# Altium project PCB_LDB-U01.PRJPCB (part 1 of 2)
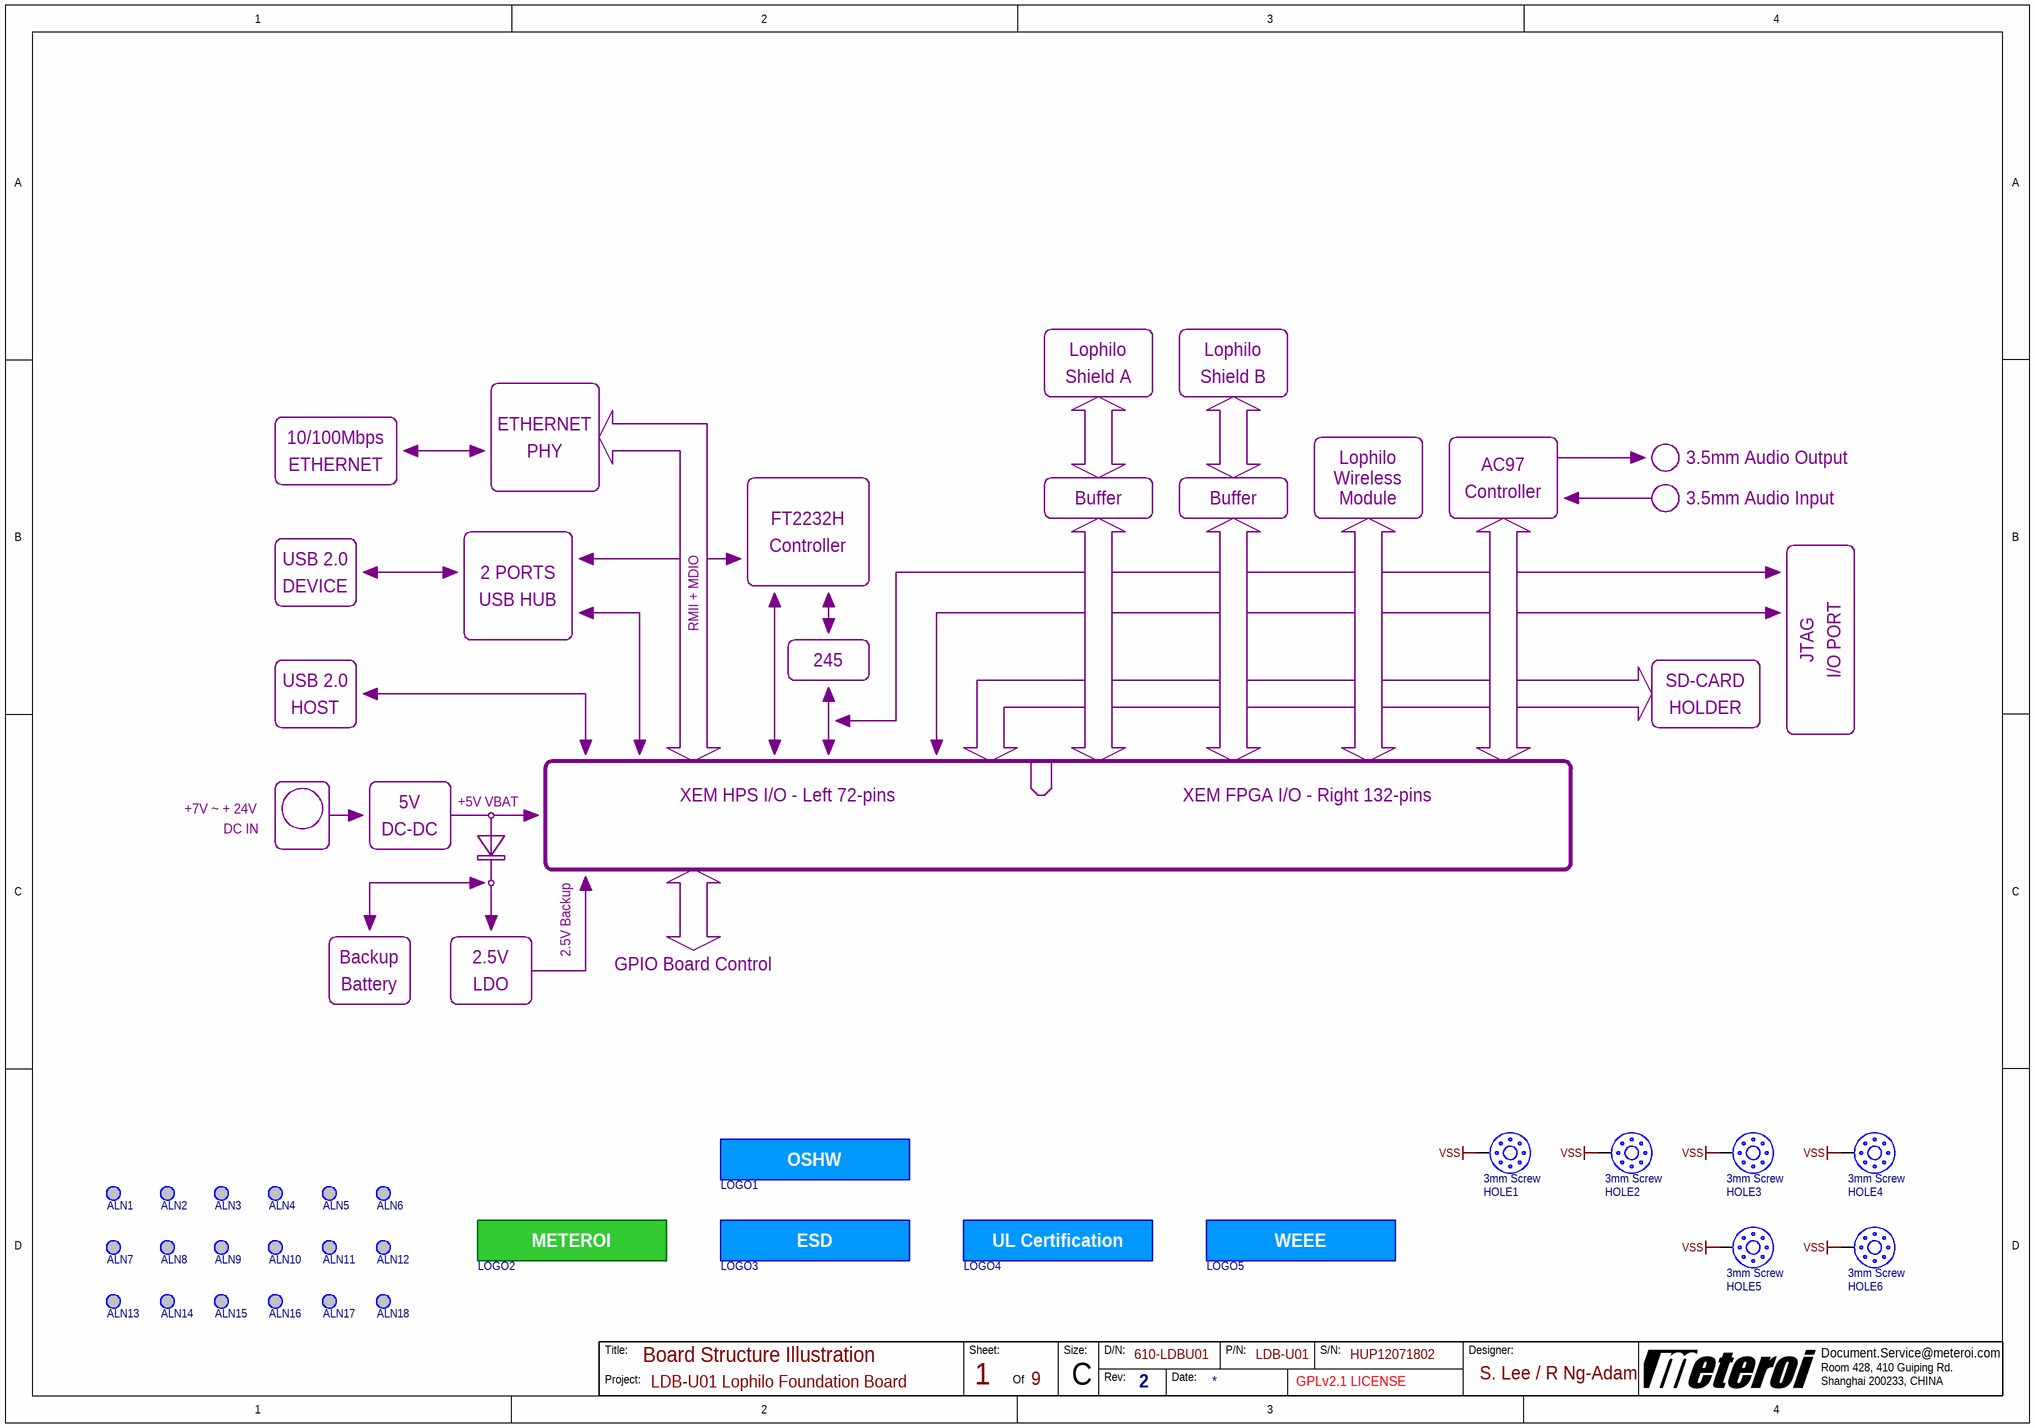
[diagram p0: 01_Structure.SchDoc]
ClassifiedLevel: GPLv2.1 LICENSE; Designer: S. Lee / R Ng-Adam; DocumentSerialNumber: 610-LDBU01; Email: Document.Service@meteroi.com; PartNumber: LDB-U01; PrjRevision: 2; SerialNumber: HUP12071802; SheetTotalNumber: 9; TopProjectName: LDB-U01 Lophilo Foundation Board
9 sheets, 286 parts. Net scope: global (net labels, ports and power ports of the same name join across sheets).
Board file: PCB_LDB-U01.PcbDoc
Sheets:
  01_Structure.SchDoc
  02_IO_PORTS.SchDoc
  03_SHIELD_SLOT_A.SchDoc
  04_SHIELD_SLOT_B.SchDoc
  05_USB_PORTS.SchDoc
  06_ETHERNET.SchDoc
  07_AC97_AUDIO.SchDoc
  08_JTAG_DEBUG.SchDoc
  09_POWER.SchDoc

## Sheet 01_Structure.SchDoc: Board Structure Illustration
size 381 x 266 mm; Organization: Meteroi; Address1: Room 428, 410 Guiping Rd.; Address2: Shanghai 200233, CHINA; SheetNumber: 1; SheetTotal: 9; PageSetup: Record=PageOptions|CenterHorizontal=True|CenterVertical=True|PrintScale=0.75|XCorrection=1.00|YCorrection=1.00|PrintKind=2|BorderSize=5000000|LeftOffset=0|BottomOffset=0|Orientation=2|PaperLength=1000|PaperWidth=1000|Scale=100|PaperSource=276|PrintQuality=-3|MediaType=1|DitherType=10|PaperKind=A4|PrintScaleMode=1

### Parts
ALN1  Assembly Optical Align  [ALIGN_1]  (value not drawn)
ALN2  Assembly Optical Align  [ALIGN_1]  (value not drawn)
ALN3  Assembly Optical Align  [ALIGN_1]  (value not drawn)
ALN4  Assembly Optical Align  [ALIGN_1]  (value not drawn)
ALN5  Assembly Optical Align  [ALIGN_1]  (value not drawn)
ALN6  Assembly Optical Align  [ALIGN_1]  (value not drawn)
ALN7  Assembly Optical Align  [ALIGN_1]  (value not drawn)
ALN8  Assembly Optical Align  [ALIGN_1]  (value not drawn)
ALN9  Assembly Optical Align  [ALIGN_1]  (value not drawn)
ALN10  Assembly Optical Align  [ALIGN_1]  (value not drawn)
ALN11  Assembly Optical Align  [ALIGN_1]  (value not drawn)
ALN12  Assembly Optical Align  [ALIGN_1]  (value not drawn)
ALN13  Assembly Optical Align  [ALIGN_1]  (value not drawn)
ALN14  Assembly Optical Align  [ALIGN_1]  (value not drawn)
ALN15  Assembly Optical Align  [ALIGN_1]  (value not drawn)
ALN16  Assembly Optical Align  [ALIGN_1]  (value not drawn)
ALN17  Assembly Optical Align  [ALIGN_1]  (value not drawn)
ALN18  Assembly Optical Align  [ALIGN_1]  (value not drawn)
HOLE1  3mm Screw  [HOLE_3_S]
HOLE2  3mm Screw  [HOLE_3_S]
HOLE3  3mm Screw  [HOLE_3_S]
HOLE4  3mm Screw  [HOLE_3_S]
HOLE5  3mm Screw  [HOLE_3_S]
HOLE6  3mm Screw  [HOLE_3_S]
LOGO1  OSHW  [LOGO_OSHW_2]  (value not drawn)
LOGO2  LOGO  [LOGO_METEROI_ST_12X3]  (value not drawn)
LOGO3  ESD  [REGULATION_ESD]  (value not drawn)
LOGO4  UL Certification  [REGULATION_PCB_UL]  (value not drawn)
LOGO5  WEEE  [REGULATION_WEEE]  (value not drawn)

### Nets
VSS: HOLE1.1(GND) HOLE2.1(GND) HOLE3.1(GND) HOLE4.1(GND) HOLE5.1(GND) HOLE6.1(GND)

### Notes on the sheet
- Lophilo
- Shield A
- Shield B
- 10/100Mbps
- ETHERNET
- PHY
- Buffer
- Module
- Wireless
- AC97
- Controller
- 3.5mm Audio Output
- 3.5mm Audio Input
- USB 2.0
- 2 PORTS
- FT2232H
- DEVICE
- USB HUB
- RMII + MDIO
- JTAG
- I/O PORT
- HOST
- 245
- SD-CARD
- HOLDER
- +7V ~ + 24V
- DC IN
- 5V
- DC-DC
- +5V VBAT
- XEM HPS I/O - Left 72-pins
- XEM FPGA I/O - Right 132-pins
- Backup
- 2.5V
- 2.5V Backup
- GPIO Board Control
- Battery
- LDO
- Title:
- Project:
- Sheet:
- Of
- Size:
- D/N:
- Rev:
- Date:
- P/N:
- S/N:
- Designer:
- C
- (in symbol LOGO_METEROI) METEROI

### Library data of the parts
ALN1-ALN18 = ALIGN: Vendor: 0; Designer: shyul; PCBMarker: Aligner; Value: Assembly Optical Align; Version: 1.0; VersionDate: 05-21-2011; SerialNumber: 0; PartNumber: 0; Publisher: Cowin
HOLE1-HOLE6 = HOLE: PCB hole for screw installations; Vendor: 0; Designer: shyul; Value: 3mm Screw; Version: 1.0; VersionDate: 05-05-2011; SerialNumber: 0; PartNumber: 0; Publisher: Cowin; PCBMarker: Hole
LOGO1 = REGULATION_OSHW: OSHW Logo; Vendor: 0; Designer: shyul; Value: OSHW; Version: 1.0; VersionDate: 06-02-2012; SerialNumber: 0; PartNumber: 0; Publisher: Cowin; PCBMarker: OSHW
LOGO2 = LOGO_METEROI: Meteroi Logo; Vendor: 0; Designer: shyul; Value: LOGO; Version: 1.0; VersionDate: 05-15-2011; SerialNumber: 0; PartNumber: 0; Publisher: Cowin; PCBMarker: LOGO
LOGO3 = REGULATION_ESD: ESD Logo; Vendor: 0; Designer: shyul; Value: ESD; Version: 1.0; VersionDate: 05-15-2011; SerialNumber: 0; PartNumber: 0; Publisher: Cowin; PCBMarker: ESD
LOGO4 = REGULATION_PCB_UL: PCB UL Certification; Vendor: 0; Designer: shyul; Value: UL Certification; Version: 1.0; VersionDate: 05-15-2011; SerialNumber: 0; PartNumber: 0; Publisher: Cowin; PCBMarker: UL Certification
LOGO5 = REGULATION_WEEE: WEEE Logo; Vendor: 0; Designer: shyul; Value: WEEE; Version: 1.0; VersionDate: 05-15-2011; SerialNumber: 0; PartNumber: 0; Publisher: Cowin; PCBMarker: WEEE

## Sheet 02_IO_PORTS.SchDoc: General IO Ports
size 381 x 266 mm; Organization: Meteroi; Address1: Room 428, 410 Guiping Rd.; Address2: Shanghai 200233, CHINA; SheetNumber: 2; SheetTotal: 9; PageSetup: Record=PageOptions|CenterHorizontal=True|CenterVertical=True|PrintScale=0.75|XCorrection=1.00|YCorrection=1.00|PrintKind=2|BorderSize=5000000|LeftOffset=0|BottomOffset=0|Orientation=2|PaperLength=1000|PaperWidth=1000|Scale=100|PaperSource=276|PrintQuality=-3|MediaType=1|DitherType=10|PaperKind=A4|PrintScaleMode=1
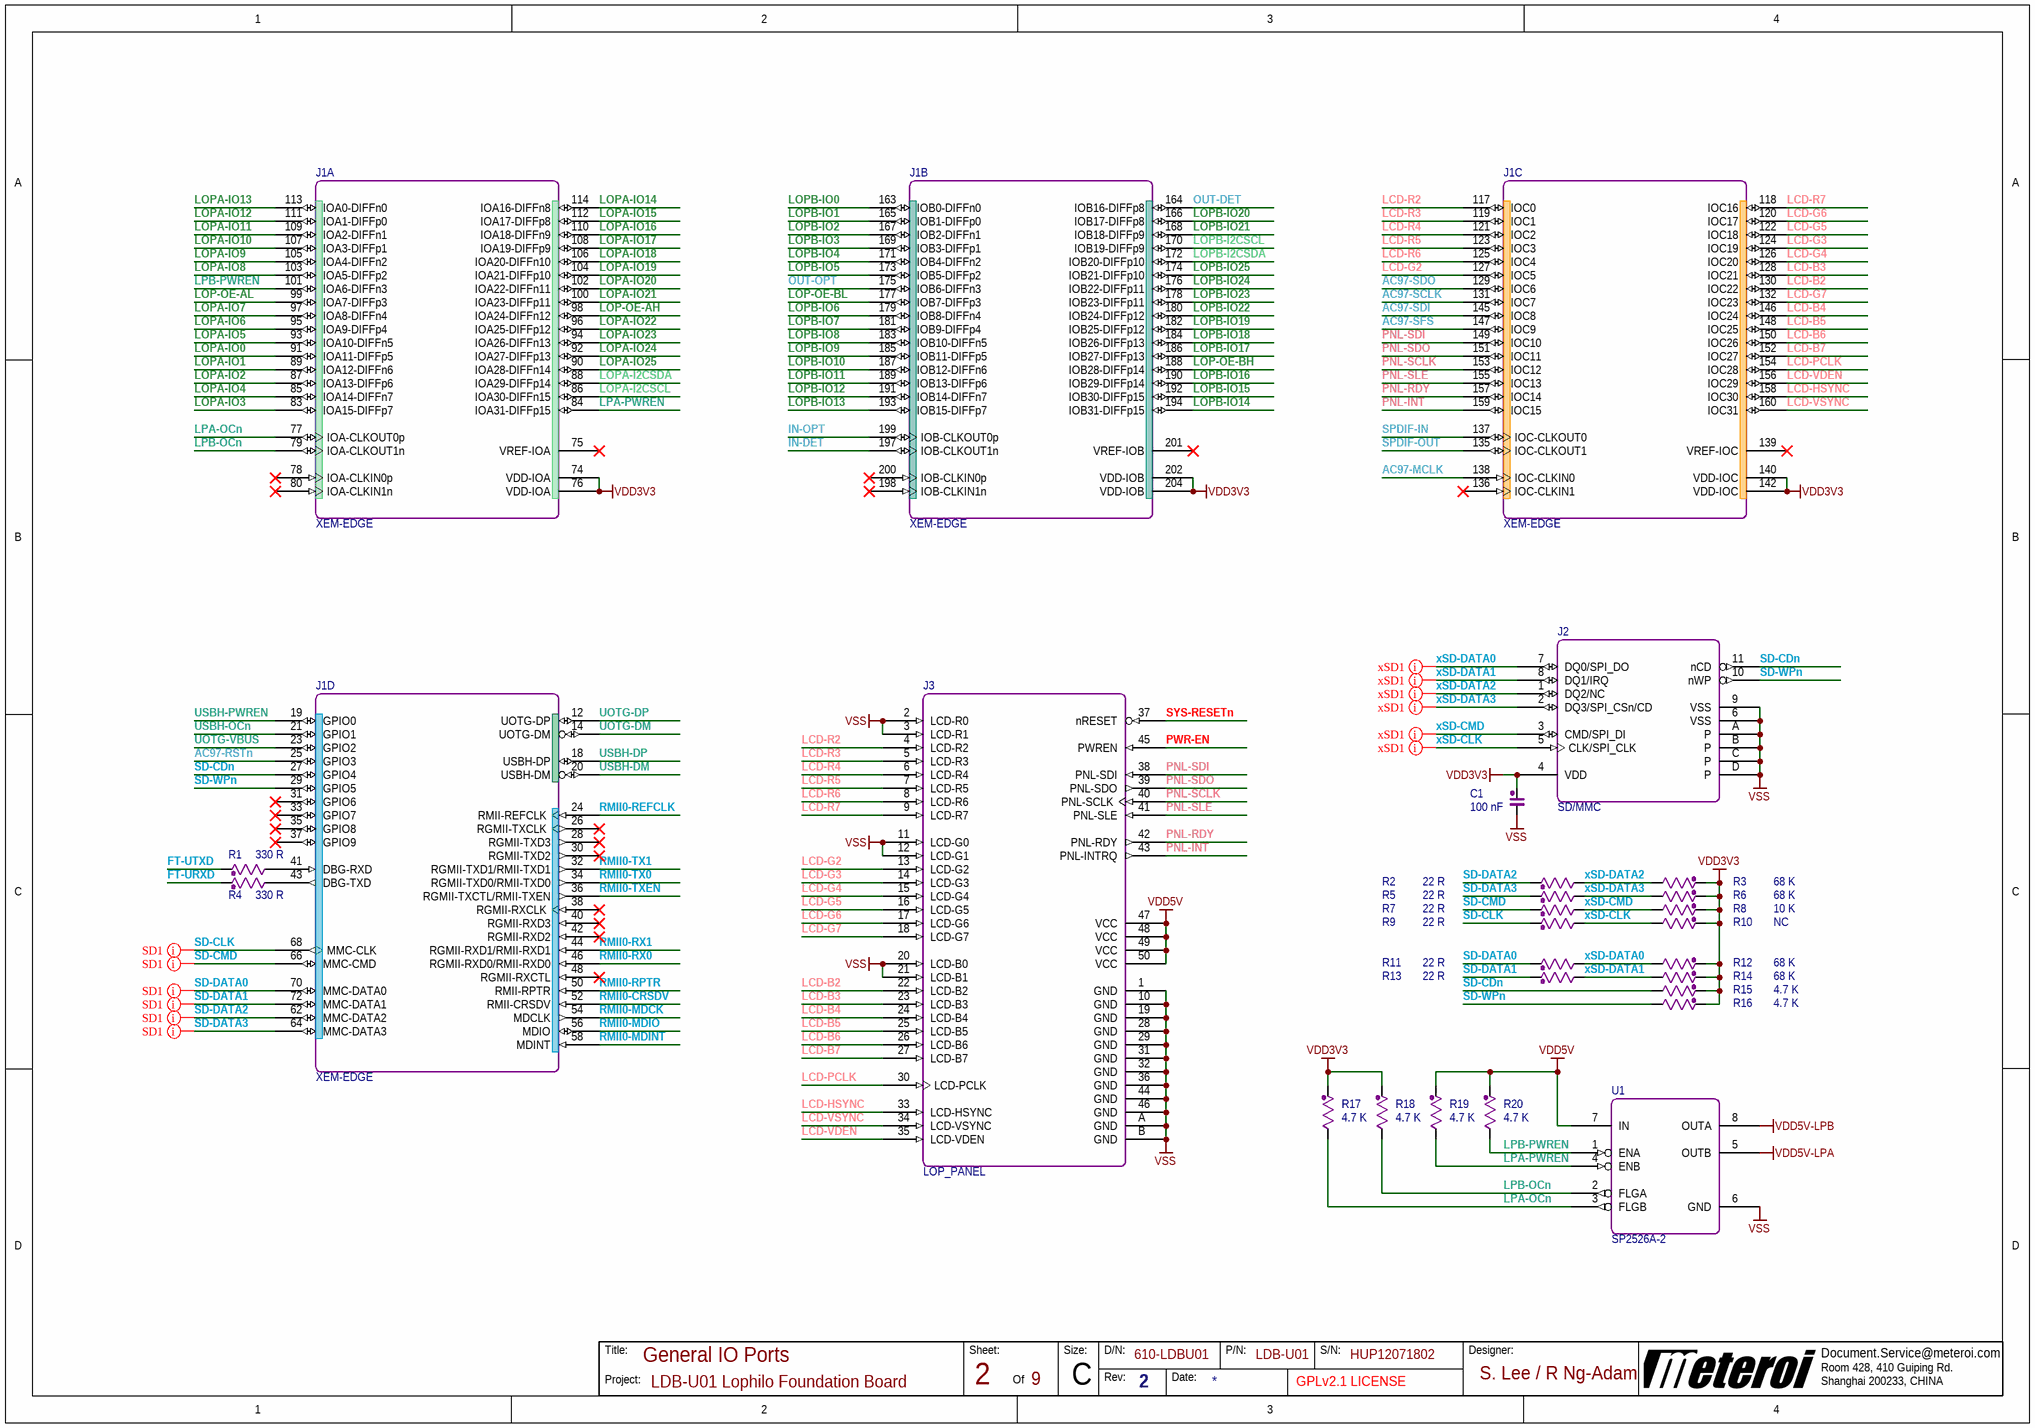
[diagram p1: 02_IO_PORTS.SchDoc]

### Parts
C1  100 nF  [0603A1]
J1  XEM-EDGE  [XEM-1S-204]  (parts A,B,C,D of 5)
J2  SD/MMC  [SD_SOCKET_C]
J3  LOP_PANEL  [FPC_0P5_50A]
R1  330 R  [0603A2]
R2  22 R  [0402A2]
R3  68 K  [0402A2]
R4  330 R  [0603A2]
R5  22 R  [0402A2]
R6  68 K  [0402A2]
R7  22 R  [0402A2]
R8  10 K  [0402A2]
R9  22 R  [0402A2]
R10  NC  [0402A2]
R11  22 R  [0402A2]
R12  68 K  [0402A2]
R13  22 R  [0402A2]
R14  68 K  [0402A2]
R15  4.7 K  [0603A2]
R16  4.7 K  [0603A2]
R17  4.7 K  [0402A2]
R18  4.7 K  [0402A2]
R19  4.7 K  [0603A2]
R20  4.7 K  [0603A2]
U1  SP2526A-2  [SOIC-8S]

### Nets
VDD3V3: C1.2 J1.74(VDD-IOA) J1.76(VDD-IOA) J1.140(VDD-IOC) J1.142(VDD-IOC) J1.202(VDD-IOB) J1.204(VDD-IOB) J2.4(VDD) R3.2 R6.2 R8.2 R10.2 R12.2 R14.2 R15.2 R16.2 R17.2 R18.2
VDD5V: J3.47(VCC) J3.48(VCC) J3.49(VCC) J3.50(VCC) R19.2 R20.2 U1.7(IN)
VDD5V-LPA: U1.5(OUTB)
VDD5V-LPB: U1.8(OUTA)
VSS: C1.1 J2.6(VSS) J2.9(VSS) J2.A(P) J2.B(P) J2.C(P) J2.D(P) J3.1(GND) J3.2(LCD-R0) J3.3(LCD-R1) J3.10(GND) J3.11(LCD-G0) J3.12(LCD-G1) J3.19(GND) J3.20(LCD-B0) J3.21(LCD-B1) J3.28(GND) J3.29(GND) J3.31(GND) J3.32(GND) J3.36(GND) J3.44(GND) J3.46(GND) J3.A(GND) J3.B(GND) U1.6(GND)
AC97-MCLK: J1.138(IOC-CLKIN0)
AC97-RSTn: J1.25(GPIO3)
AC97-SCLK: J1.131(IOC7)
AC97-SDI: J1.145(IOC8)
AC97-SDO: J1.129(IOC6)
AC97-SFS: J1.147(IOC9)
FT-URXD: R4.2
FT-UTXD: R1.2
IN-DET: J1.197(IOB-CLKOUT1n)
IN-OPT: J1.199(IOB-CLKOUT0p)
LCD-B2: J1.130(IOC22) J3.22(LCD-B2)
LCD-B3: J1.128(IOC21) J3.23(LCD-B3)
LCD-B4: J1.146(IOC24) J3.24(LCD-B4)
LCD-B5: J1.148(IOC25) J3.25(LCD-B5)
LCD-B6: J1.150(IOC26) J3.26(LCD-B6)
LCD-B7: J1.152(IOC27) J3.27(LCD-B7)
LCD-G2: J1.127(IOC5) J3.13(LCD-G2)
LCD-G3: J1.124(IOC19) J3.14(LCD-G3)
LCD-G4: J1.126(IOC20) J3.15(LCD-G4)
LCD-G5: J1.122(IOC18) J3.16(LCD-G5)
LCD-G6: J1.120(IOC17) J3.17(LCD-G6)
LCD-G7: J1.132(IOC23) J3.18(LCD-G7)
LCD-HSYNC: J1.158(IOC30) J3.33(LCD-HSYNC)
LCD-PCLK: J1.154(IOC28) J3.30(LCD-PCLK)
LCD-R2: J1.117(IOC0) J3.4(LCD-R2)
LCD-R3: J1.119(IOC1) J3.5(LCD-R3)
LCD-R4: J1.121(IOC2) J3.6(LCD-R4)
LCD-R5: J1.123(IOC3) J3.7(LCD-R5)
LCD-R6: J1.125(IOC4) J3.8(LCD-R6)
LCD-R7: J1.118(IOC16) J3.9(LCD-R7)
LCD-VDEN: J1.156(IOC29) J3.35(LCD-VDEN)
LCD-VSYNC: J1.160(IOC31) J3.34(LCD-VSYNC)
LOP-OE-AH: J1.98(IOA24-DIFFn12)
LOP-OE-AL: J1.99(IOA7-DIFFp3)
LOP-OE-BH: J1.188(IOB28-DIFFp14)
LOP-OE-BL: J1.177(IOB7-DIFFp3)
LOPA-I2CSCL: J1.86(IOA30-DIFFn15)
LOPA-I2CSDA: J1.88(IOA29-DIFFp14)
LOPA-IO0: J1.91(IOA11-DIFFp5)
LOPA-IO1: J1.89(IOA12-DIFFn6)
LOPA-IO2: J1.87(IOA13-DIFFp6)
LOPA-IO3: J1.83(IOA15-DIFFp7)
LOPA-IO4: J1.85(IOA14-DIFFn7)
LOPA-IO5: J1.93(IOA10-DIFFn5)
LOPA-IO6: J1.95(IOA9-DIFFp4)
LOPA-IO7: J1.97(IOA8-DIFFn4)
LOPA-IO8: J1.103(IOA5-DIFFp2)
LOPA-IO9: J1.105(IOA4-DIFFn2)
LOPA-IO10: J1.107(IOA3-DIFFp1)
LOPA-IO11: J1.109(IOA2-DIFFn1)
LOPA-IO12: J1.111(IOA1-DIFFp0)
LOPA-IO13: J1.113(IOA0-DIFFn0)
LOPA-IO14: J1.114(IOA16-DIFFn8)
LOPA-IO15: J1.112(IOA17-DIFFp8)
LOPA-IO16: J1.110(IOA18-DIFFn9)
LOPA-IO17: J1.108(IOA19-DIFFp9)
LOPA-IO18: J1.106(IOA20-DIFFn10)
LOPA-IO19: J1.104(IOA21-DIFFp10)
LOPA-IO20: J1.102(IOA22-DIFFn11)
LOPA-IO21: J1.100(IOA23-DIFFp11)
LOPA-IO22: J1.96(IOA25-DIFFp12)
LOPA-IO23: J1.94(IOA26-DIFFn13)
LOPA-IO24: J1.92(IOA27-DIFFp13)
LOPA-IO25: J1.90(IOA28-DIFFn14)
LOPB-I2CSCL: J1.170(IOB19-DIFFp9)
LOPB-I2CSDA: J1.172(IOB20-DIFFp10)
LOPB-IO0: J1.163(IOB0-DIFFn0)
LOPB-IO1: J1.165(IOB1-DIFFp0)
LOPB-IO2: J1.167(IOB2-DIFFn1)
LOPB-IO3: J1.169(IOB3-DIFFp1)
LOPB-IO4: J1.171(IOB4-DIFFn2)
LOPB-IO5: J1.173(IOB5-DIFFp2)
LOPB-IO6: J1.179(IOB8-DIFFn4)
LOPB-IO7: J1.181(IOB9-DIFFp4)
LOPB-IO8: J1.183(IOB10-DIFFn5)
LOPB-IO9: J1.185(IOB11-DIFFp5)
LOPB-IO10: J1.187(IOB12-DIFFn6)
LOPB-IO11: J1.189(IOB13-DIFFp6)
LOPB-IO12: J1.191(IOB14-DIFFn7)
LOPB-IO13: J1.193(IOB15-DIFFp7)
LOPB-IO14: J1.194(IOB31-DIFFp15)
LOPB-IO15: J1.192(IOB30-DIFFp15)
LOPB-IO16: J1.190(IOB29-DIFFp14)
LOPB-IO17: J1.186(IOB27-DIFFp13)
LOPB-IO18: J1.184(IOB26-DIFFp13)
LOPB-IO19: J1.182(IOB25-DIFFp12)
LOPB-IO20: J1.166(IOB17-DIFFp8)
LOPB-IO21: J1.168(IOB18-DIFFp9)
LOPB-IO22: J1.180(IOB24-DIFFp12)
LOPB-IO23: J1.178(IOB23-DIFFp11)
LOPB-IO24: J1.176(IOB22-DIFFp11)
LOPB-IO25: J1.174(IOB21-DIFFp10)
LPA-OCn: J1.77(IOA-CLKOUT0p) R17.1 U1.3(FLGB)
LPA-PWREN: J1.84(IOA31-DIFFp15) R19.1 U1.4(ENB)
LPB-OCn: J1.79(IOA-CLKOUT1n) R18.1 U1.2(FLGA)
LPB-PWREN: J1.101(IOA6-DIFFn3) R20.1 U1.1(ENA)
OUT-DET: J1.164(IOB16-DIFFp8)
OUT-OPT: J1.175(IOB6-DIFFn3)
PNL-INT: J1.159(IOC15) J3.43(PNL-INTRQ)
PNL-RDY: J1.157(IOC14) J3.42(PNL-RDY)
PNL-SCLK: J1.153(IOC12) J3.40(PNL-SCLK)
PNL-SDI: J1.149(IOC10) J3.38(PNL-SDI)
PNL-SDO: J1.151(IOC11) J3.39(PNL-SDO)
PNL-SLE: J1.155(IOC13) J3.41(PNL-SLE)
PWR-EN: J3.45(PWREN)
RMII0-CRSDV: J1.52(RMII-CRSDV)
RMII0-MDCK: J1.54(MDCLK)
RMII0-MDINT: J1.58(MDINT)
RMII0-MDIO: J1.56(MDIO)
RMII0-REFCLK: J1.24(RMII-REFCLK)
RMII0-RPTR: J1.50(RMII-RPTR)
RMII0-RX0: J1.46(RGMII-RXD0/RMII-RXD0)
RMII0-RX1: J1.44(RGMII-RXD1/RMII-RXD1)
RMII0-TX0: J1.34(RGMII-TXD0/RMII-TXD0)
RMII0-TX1: J1.32(RGMII-TXD1/RMII-TXD1)
RMII0-TXEN: J1.36(RGMII-TXCTL/RMII-TXEN)
SD-CDn: J1.27(GPIO4) J2.11(nCD) R15.1
SD-CLK: J1.68(MMC-CLK) R9.2
SD-CMD: J1.66(MMC-CMD) R7.2
SD-DATA0: J1.70(MMC-DATA0) R11.2
SD-DATA1: J1.72(MMC-DATA1) R13.2
SD-DATA2: J1.62(MMC-DATA2) R2.2
SD-DATA3: J1.64(MMC-DATA3) R5.2
SD-WPn: J1.29(GPIO5) J2.10(nWP) R16.1
SPDIF-IN: J1.137(IOC-CLKOUT0)
SPDIF-OUT: J1.135(IOC-CLKOUT1)
SYS-RESETn: J3.37(nRESET)
UOTG-DM: J1.14(UOTG-DM)
UOTG-DP: J1.12(UOTG-DP)
UOTG-VBUS: J1.23(GPIO2)
USBH-DM: J1.20(USBH-DM)
USBH-DP: J1.18(USBH-DP)
USBH-OCn: J1.21(GPIO1)
USBH-PWREN: J1.19(GPIO0)
xSD-CLK: J2.5(CLK/SPI_CLK) R9.1 R10.1
xSD-CMD: J2.3(CMD/SPI_DI) R7.1 R8.1
xSD-DATA0: J2.7(DQ0/SPI_DO) R11.1 R12.1
xSD-DATA1: J2.8(DQ1/IRQ) R13.1 R14.1
xSD-DATA2: J2.1(DQ2/NC) R2.1 R3.1
xSD-DATA3: J2.2(DQ3/SPI_CSn/CD) R5.1 R6.1
NetJ1_41: J1.41(DBG-RXD) R1.1
NetJ1_43: J1.43(DBG-TXD) R4.1

Not connected (* = marked no-connect by the designer): J1 26(RGMII-TXCLK)* 28(RGMII-TXD3)* 30(RGMII-TXD2)* 31(GPIO6)* 33(GPIO7)* 35(GPIO8)* 37(GPIO9)* 38(RGMII-RXCLK)* 40(RGMII-RXD3)* 42(RGMII-RXD2)* 48(RGMII-RXCTL)* 75(VREF-IOA)* 78(IOA-CLKIN0p)* 80(IOA-CLKIN1n)* 136(IOC-CLKIN1)* 139(VREF-IOC)* 198(IOB-CLKIN1n)* 200(IOB-CLKIN0p)* 201(VREF-IOB)*

### Layout directives
net class xSD1: xSD-CLK, xSD-CMD, xSD-DATA0, xSD-DATA1, xSD-DATA2, xSD-DATA3
net class SD1: SD-CLK, SD-CMD, SD-DATA0, SD-DATA1, SD-DATA2, SD-DATA3

### Notes on the sheet
- Title:
- Project:
- Sheet:
- Of
- Size:
- D/N:
- Rev:
- Date:
- P/N:
- S/N:
- Designer:
- C

### Library data of the parts
C1 = CAP: Normal Capacitor; PartNumber: 0; Vendor: muRata; Designer: shyul; PinCountSMD: 2; Value: 100 nF; SerialNumber: 0; Publisher: Cowin; PCBMarker: Capacitor; Version: 1.0; VersionDate: 04-27-2011; PinCountHole: 0
J1 = XEM-SLOT: XEM Edge Connector 204-pins; Vendor: Cowin; PinCountSMD: 0; Designer: shyul; Value: XEM-EDGE; PartNumber: XEM-EDGE; Version: 1.0; VersionDate: 03-09-2012; PinCountHole: 0; SerialNumber: 0; Publisher: Cowin; PCBMarker: XEM
J2 = SD_JACK_2: SD/MMC CARD Socket; PartNumber: 2041021-1; SerialNumber: 0; Vendor: Tyco; PinCountSMD: 15; Designer: shyul; PCBMarker: SD/MMC; PinCountHole: 0; Value: SD/MMC; Version: 1.0; VersionDate: 05-10-2011; Publisher: Cowin
J3 = LOP_PANEL: Lophilo Panel Interface; Vendor: 0; PinCountHole: 52; Designer: shyul; Value: LOP_PANEL; PartNumber: LOP_PANEL; Version: 1.0; VersionDate: 06-03-2012; PinCountSMD: 0; SerialNumber: 0; Publisher: Cowin; PCBMarker: LOP_PANEL
R1-R20 = RES: Normal Resistor; PartNumber: 0; Vendor: KOA; Designer: shyul; PinCountSMD: 2; SerialNumber: 0; Version: 1.0; VersionDate: 04-27-2011; PCBMarker: Resistor; Publisher: Cowin; PinCountHole: 0
  R1 R4: Value: 330 R
  R2 R5 R7 R9 R11 R13: Value: 22 R
  R3 R6 R12 R14: Value: 68 K
  R8: Value: 10 K
  R10: Value: NC
  R15-R20: Value: 4.7 K
U1 = SP2526A-2: Power Switch; PartNumber: SP2526A-2EN; Vendor: EXAR; PinCountSMD: 29; PinCountHole: 0; Designer: shyul; PCBMarker: PHY; Value: SP2526A-2; Version: 1.0; VersionDate: 03-26-2012; SerialNumber: 0; Publisher: Cowin

## Sheet 03_SHIELD_SLOT_A.SchDoc: Slot A for Lophilo Shield
size 381 x 266 mm; Organization: Meteroi; Address1: Room 428, 410 Guiping Rd.; Address2: Shanghai 200233, CHINA; SheetNumber: 3; SheetTotal: 9; PageSetup: Record=PageOptions|CenterHorizontal=True|CenterVertical=True|PrintScale=0.75|XCorrection=1.00|YCorrection=1.00|PrintKind=2|BorderSize=5000000|LeftOffset=0|BottomOffset=0|Orientation=2|PaperLength=1000|PaperWidth=1000|Scale=100|PaperSource=276|PrintQuality=-3|MediaType=1|DitherType=10|PaperKind=A4|PrintScaleMode=1
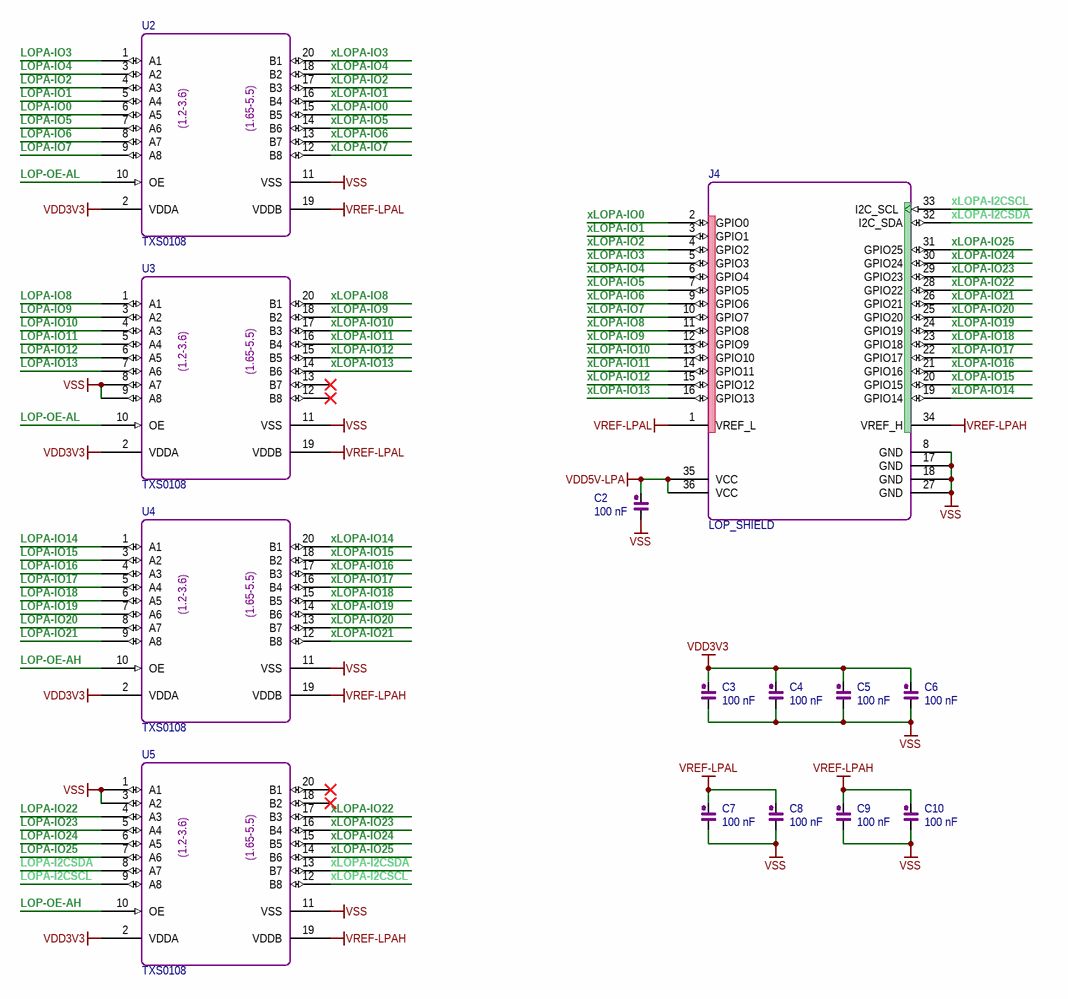
[diagram p2: 03_SHIELD_SLOT_A.SchDoc]

### Parts
C2  100 nF  [0603A1]
C3  100 nF  [0603A1]
C4  100 nF  [0603A1]
C5  100 nF  [0603A1]
C6  100 nF  [0603A1]
C7  100 nF  [0603A1]
C8  100 nF  [0603A1]
C9  100 nF  [0603A1]
C10  100 nF  [0603A1]
J4  LOP_SHIELD  [LOP_SHIELD]
U2  TXS0108  [TSSOP-20]
U3  TXS0108  [TSSOP-20]
U4  TXS0108  [TSSOP-20]
U5  TXS0108  [TSSOP-20]

### Nets
VDD3V3: C3.2 C4.2 C5.2 C6.2 U2.2(VDDA) U3.2(VDDA) U4.2(VDDA) U5.2(VDDA)
VDD5V-LPA: C2.2 J4.35(VCC) J4.36(VCC)
VREF-LPAH: C9.2 C10.2 J4.34(VREF_H) U4.19(VDDB) U5.19(VDDB)
VREF-LPAL: C7.2 C8.2 J4.1(VREF_L) U2.19(VDDB) U3.19(VDDB)
VSS: C2.1 C3.1 C4.1 C5.1 C6.1 C7.1 C8.1 C9.1 C10.1 J4.8(GND) J4.17(GND) J4.18(GND) J4.27(GND) U2.11(VSS) U3.8(A7) U3.9(A8) U3.11(VSS) U4.11(VSS) U5.1(A1) U5.3(A2) U5.11(VSS)
LOP-OE-AH: U4.10(OE) U5.10(OE)
LOP-OE-AL: U2.10(OE) U3.10(OE)
LOPA-I2CSCL: U5.9(A8)
LOPA-I2CSDA: U5.8(A7)
LOPA-IO0: U2.6(A5)
LOPA-IO1: U2.5(A4)
LOPA-IO2: U2.4(A3)
LOPA-IO3: U2.1(A1)
LOPA-IO4: U2.3(A2)
LOPA-IO5: U2.7(A6)
LOPA-IO6: U2.8(A7)
LOPA-IO7: U2.9(A8)
LOPA-IO8: U3.1(A1)
LOPA-IO9: U3.3(A2)
LOPA-IO10: U3.4(A3)
LOPA-IO11: U3.5(A4)
LOPA-IO12: U3.6(A5)
LOPA-IO13: U3.7(A6)
LOPA-IO14: U4.1(A1)
LOPA-IO15: U4.3(A2)
LOPA-IO16: U4.4(A3)
LOPA-IO17: U4.5(A4)
LOPA-IO18: U4.6(A5)
LOPA-IO19: U4.7(A6)
LOPA-IO20: U4.8(A7)
LOPA-IO21: U4.9(A8)
LOPA-IO22: U5.4(A3)
LOPA-IO23: U5.5(A4)
LOPA-IO24: U5.6(A5)
LOPA-IO25: U5.7(A6)
xLOPA-I2CSCL: J4.33(I2C_SCL) U5.12(B8)
xLOPA-I2CSDA: J4.32(I2C_SDA) U5.13(B7)
xLOPA-IO0: J4.2(GPIO0) U2.15(B5)
xLOPA-IO1: J4.3(GPIO1) U2.16(B4)
xLOPA-IO2: J4.4(GPIO2) U2.17(B3)
xLOPA-IO3: J4.5(GPIO3) U2.20(B1)
xLOPA-IO4: J4.6(GPIO4) U2.18(B2)
xLOPA-IO5: J4.7(GPIO5) U2.14(B6)
xLOPA-IO6: J4.9(GPIO6) U2.13(B7)
xLOPA-IO7: J4.10(GPIO7) U2.12(B8)
xLOPA-IO8: J4.11(GPIO8) U3.20(B1)
xLOPA-IO9: J4.12(GPIO9) U3.18(B2)
xLOPA-IO10: J4.13(GPIO10) U3.17(B3)
xLOPA-IO11: J4.14(GPIO11) U3.16(B4)
xLOPA-IO12: J4.15(GPIO12) U3.15(B5)
xLOPA-IO13: J4.16(GPIO13) U3.14(B6)
xLOPA-IO14: J4.19(GPIO14) U4.20(B1)
xLOPA-IO15: J4.20(GPIO15) U4.18(B2)
xLOPA-IO16: J4.21(GPIO16) U4.17(B3)
xLOPA-IO17: J4.22(GPIO17) U4.16(B4)
xLOPA-IO18: J4.23(GPIO18) U4.15(B5)
xLOPA-IO19: J4.24(GPIO19) U4.14(B6)
xLOPA-IO20: J4.25(GPIO20) U4.13(B7)
xLOPA-IO21: J4.26(GPIO21) U4.12(B8)
xLOPA-IO22: J4.28(GPIO22) U5.17(B3)
xLOPA-IO23: J4.29(GPIO23) U5.16(B4)
xLOPA-IO24: J4.30(GPIO24) U5.15(B5)
xLOPA-IO25: J4.31(GPIO25) U5.14(B6)

Not connected (* = marked no-connect by the designer): U3 12(B8)* 13(B7)*; U5 18(B2)* 20(B1)*

### Notes on the sheet
- Title:
- Project:
- Sheet:
- Of
- Size:
- D/N:
- Rev:
- Date:
- P/N:
- S/N:
- Designer:
- C
- (in symbol TXS0108) (1.2-3.6); (1.65-5.5)

### Library data of the parts
C2-C10 = CAP: as C1 on sheet 02_IO_PORTS; Value: 100 nF; SerialNumber: 0; Publisher: Cowin; PCBMarker: Capacitor; Version: 1.0; VersionDate: 04-27-2011; PinCountHole: 0
J4 = LOP_SHIELD: Lophilo Shield Module Slot; Vendor: 0; PinCountHole: 36; Designer: shyul; Value: LOP_SHIELD; PartNumber: LOP_SHIELD; Version: 1.0; VersionDate: 03-19-2012; PinCountSMD: 0; SerialNumber: 0; Publisher: Cowin; PCBMarker: LOP_SHIELD
U2-U5 = TXS0108: 8-bit Translator; Vendor: TI; Designer: shyul; PinCountSMD: 20; PinCountHole: 0; PCBMarker: 8-bit Translator; PartNumber: TXS0108; Value: TXS0108; Version: 1.0; VersionDate: 05-23-2011; Publisher: Cowin; SerialNumber: 0

## Sheet 04_SHIELD_SLOT_B.SchDoc: Slot B for Lophilo Shield
size 381 x 266 mm; Organization: Meteroi; Address1: Room 428, 410 Guiping Rd.; Address2: Shanghai 200233, CHINA; SheetNumber: 4; SheetTotal: 9; PageSetup: Record=PageOptions|CenterHorizontal=True|CenterVertical=True|PrintScale=0.75|XCorrection=1.00|YCorrection=1.00|PrintKind=2|BorderSize=5000000|LeftOffset=0|BottomOffset=0|Orientation=2|PaperLength=1000|PaperWidth=1000|Scale=100|PaperSource=276|PrintQuality=-3|MediaType=1|DitherType=10|PaperKind=A4|PrintScaleMode=1
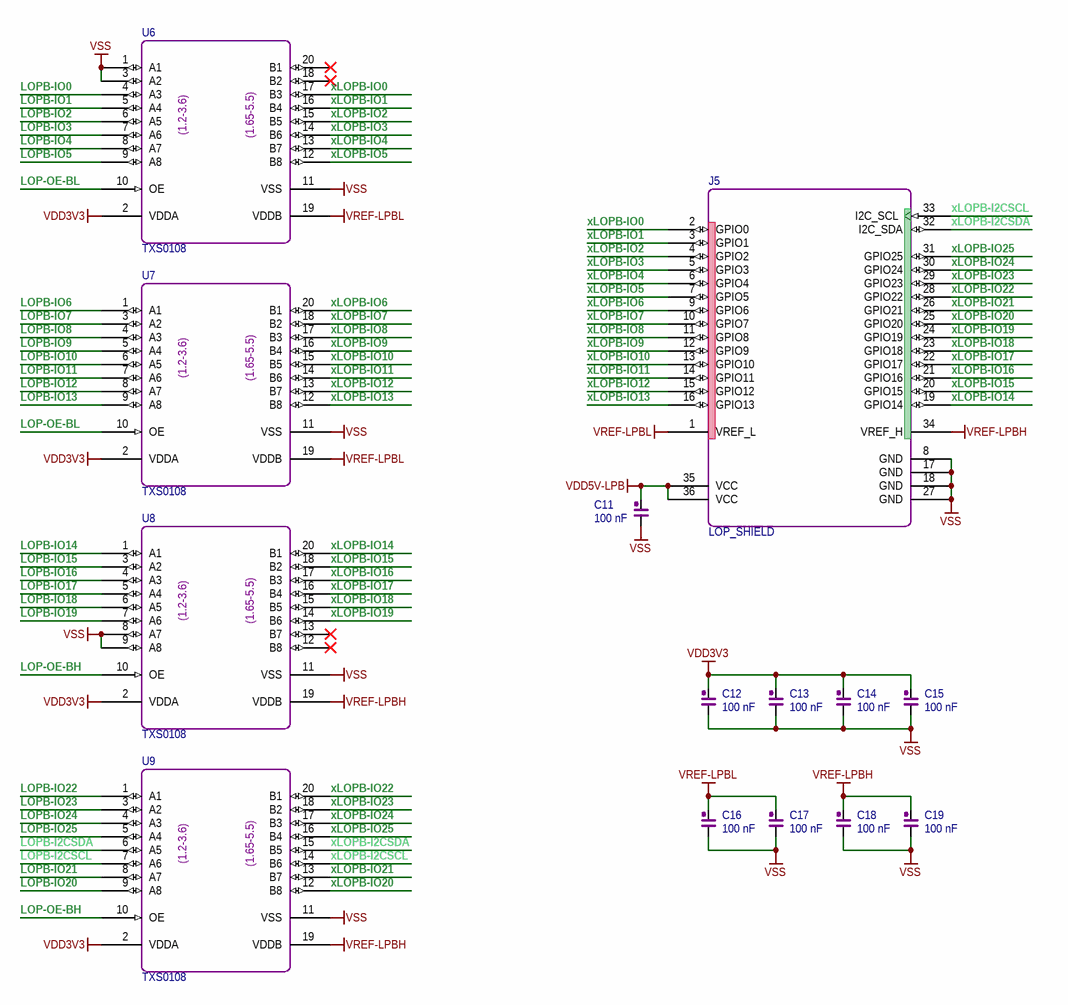
[diagram p3: 04_SHIELD_SLOT_B.SchDoc]

### Parts
C11  100 nF  [0603A1]
C12  100 nF  [0603A1]
C13  100 nF  [0603A1]
C14  100 nF  [0603A1]
C15  100 nF  [0603A1]
C16  100 nF  [0603A1]
C17  100 nF  [0603A1]
C18  100 nF  [0603A1]
C19  100 nF  [0603A1]
J5  LOP_SHIELD  [LOP_SHIELD]
U6  TXS0108  [TSSOP-20]
U7  TXS0108  [TSSOP-20]
U8  TXS0108  [TSSOP-20]
U9  TXS0108  [TSSOP-20]

### Nets
VDD3V3: C12.2 C13.2 C14.2 C15.2 U6.2(VDDA) U7.2(VDDA) U8.2(VDDA) U9.2(VDDA)
VDD5V-LPB: C11.2 J5.35(VCC) J5.36(VCC)
VREF-LPBH: C18.2 C19.2 J5.34(VREF_H) U8.19(VDDB) U9.19(VDDB)
VREF-LPBL: C16.2 C17.2 J5.1(VREF_L) U6.19(VDDB) U7.19(VDDB)
VSS: C11.1 C12.1 C13.1 C14.1 C15.1 C16.1 C17.1 C18.1 C19.1 J5.8(GND) J5.17(GND) J5.18(GND) J5.27(GND) U6.1(A1) U6.3(A2) U6.11(VSS) U7.11(VSS) U8.8(A7) U8.9(A8) U8.11(VSS) U9.11(VSS)
LOP-OE-BH: U8.10(OE) U9.10(OE)
LOP-OE-BL: U6.10(OE) U7.10(OE)
LOPB-I2CSCL: U9.7(A6)
LOPB-I2CSDA: U9.6(A5)
LOPB-IO0: U6.4(A3)
LOPB-IO1: U6.5(A4)
LOPB-IO2: U6.6(A5)
LOPB-IO3: U6.7(A6)
LOPB-IO4: U6.8(A7)
LOPB-IO5: U6.9(A8)
LOPB-IO6: U7.1(A1)
LOPB-IO7: U7.3(A2)
LOPB-IO8: U7.4(A3)
LOPB-IO9: U7.5(A4)
LOPB-IO10: U7.6(A5)
LOPB-IO11: U7.7(A6)
LOPB-IO12: U7.8(A7)
LOPB-IO13: U7.9(A8)
LOPB-IO14: U8.1(A1)
LOPB-IO15: U8.3(A2)
LOPB-IO16: U8.4(A3)
LOPB-IO17: U8.5(A4)
LOPB-IO18: U8.6(A5)
LOPB-IO19: U8.7(A6)
LOPB-IO20: U9.9(A8)
LOPB-IO21: U9.8(A7)
LOPB-IO22: U9.1(A1)
LOPB-IO23: U9.3(A2)
LOPB-IO24: U9.4(A3)
LOPB-IO25: U9.5(A4)
xLOPB-I2CSCL: J5.33(I2C_SCL) U9.14(B6)
xLOPB-I2CSDA: J5.32(I2C_SDA) U9.15(B5)
xLOPB-IO0: J5.2(GPIO0) U6.17(B3)
xLOPB-IO1: J5.3(GPIO1) U6.16(B4)
xLOPB-IO2: J5.4(GPIO2) U6.15(B5)
xLOPB-IO3: J5.5(GPIO3) U6.14(B6)
xLOPB-IO4: J5.6(GPIO4) U6.13(B7)
xLOPB-IO5: J5.7(GPIO5) U6.12(B8)
xLOPB-IO6: J5.9(GPIO6) U7.20(B1)
xLOPB-IO7: J5.10(GPIO7) U7.18(B2)
xLOPB-IO8: J5.11(GPIO8) U7.17(B3)
xLOPB-IO9: J5.12(GPIO9) U7.16(B4)
xLOPB-IO10: J5.13(GPIO10) U7.15(B5)
xLOPB-IO11: J5.14(GPIO11) U7.14(B6)
xLOPB-IO12: J5.15(GPIO12) U7.13(B7)
xLOPB-IO13: J5.16(GPIO13) U7.12(B8)
xLOPB-IO14: J5.19(GPIO14) U8.20(B1)
xLOPB-IO15: J5.20(GPIO15) U8.18(B2)
xLOPB-IO16: J5.21(GPIO16) U8.17(B3)
xLOPB-IO17: J5.22(GPIO17) U8.16(B4)
xLOPB-IO18: J5.23(GPIO18) U8.15(B5)
xLOPB-IO19: J5.24(GPIO19) U8.14(B6)
xLOPB-IO20: J5.25(GPIO20) U9.12(B8)
xLOPB-IO21: J5.26(GPIO21) U9.13(B7)
xLOPB-IO22: J5.28(GPIO22) U9.20(B1)
xLOPB-IO23: J5.29(GPIO23) U9.18(B2)
xLOPB-IO24: J5.30(GPIO24) U9.17(B3)
xLOPB-IO25: J5.31(GPIO25) U9.16(B4)

Not connected (* = marked no-connect by the designer): U6 18(B2)* 20(B1)*; U8 12(B8)* 13(B7)*

### Notes on the sheet
- Title:
- Project:
- Sheet:
- Of
- Size:
- D/N:
- Rev:
- Date:
- P/N:
- S/N:
- Designer:
- C
- (in symbol TXS0108) (1.2-3.6); (1.65-5.5)

### Library data of the parts
C11-C19 = CAP: as C1 on sheet 02_IO_PORTS; Value: 100 nF; SerialNumber: 0; Publisher: Cowin; PCBMarker: Capacitor; Version: 1.0; VersionDate: 04-27-2011; PinCountHole: 0
J5 = LOP_SHIELD: as J4 on sheet 03_SHIELD_SLOT_A; Value: LOP_SHIELD; PartNumber: LOP_SHIELD; Version: 1.0; VersionDate: 03-19-2012; PinCountSMD: 0; SerialNumber: 0; Publisher: Cowin; PCBMarker: LOP_SHIELD
U6-U9 = TXS0108: as U2 on sheet 03_SHIELD_SLOT_A; PCBMarker: 8-bit Translator; PartNumber: TXS0108; Value: TXS0108; Version: 1.0; VersionDate: 05-23-2011; Publisher: Cowin; SerialNumber: 0

## Sheet 05_USB_PORTS.SchDoc: USB Host and Device Ports
size 381 x 266 mm; Organization: Meteroi; Address1: Room 428, 410 Guiping Rd.; Address2: Shanghai 200233, CHINA; SheetNumber: 5; SheetTotal: 9; PageSetup: Record=PageOptions|CenterHorizontal=True|CenterVertical=True|PrintScale=0.75|XCorrection=1.00|YCorrection=1.00|PrintKind=2|BorderSize=5000000|LeftOffset=0|BottomOffset=0|Orientation=2|PaperLength=1000|PaperWidth=1000|Scale=100|PaperSource=276|PrintQuality=-3|MediaType=1|DitherType=10|PaperKind=A4|PrintScaleMode=1
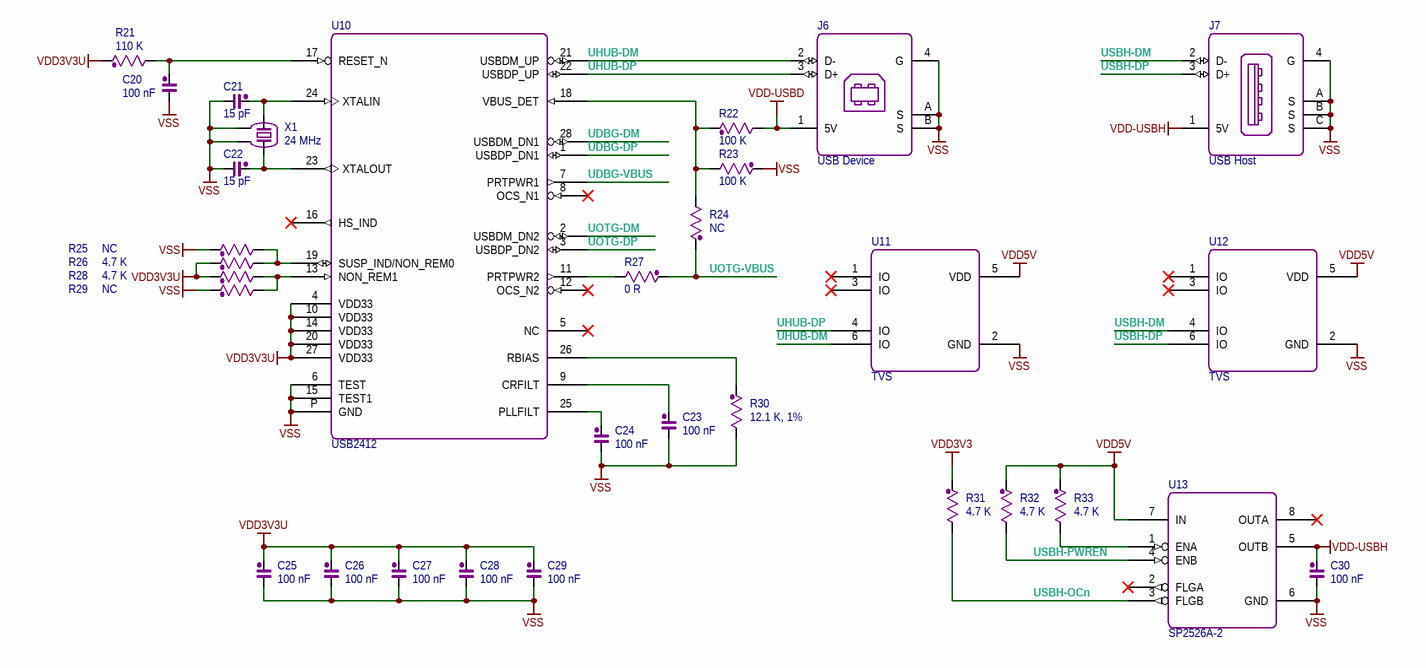
[diagram p4: 05_USB_PORTS.SchDoc]

### Parts
C20  100 nF  [0402A1]
C21  15 pF  [0402A1]
C22  15 pF  [0402A1]
C23  100 nF  [0402A1]
C24  100 nF  [0402A1]
C25  100 nF  [0402A1]
C26  100 nF  [0402A1]
C27  100 nF  [0402A1]
C28  100 nF  [0402A1]
C29  100 nF  [0402A1]
C30  100 nF  [0603A1]
J6  USB Device  [USBD1A]
J7  USB Host  [USBH1C]
R21  110 K  [0402A2]
R22  100 K  [0603A2]
R23  100 K  [0603A2]
R24  NC  [0603A2]
R25  NC  [0402A2]
R26  4.7 K  [0402A2]
R27  0 R  [0603A2]
R28  4.7 K  [0402A2]
R29  NC  [0402A2]
R30  12.1 K, 1%  [0402A2]
R31  4.7 K  [0603A2]
R32  4.7 K  [0603A2]
R33  4.7 K  [0603A2]
U10  USB2412  [QFN-5-28]
U11  TVS  [SOT-23-6]
U12  TVS  [SOT-23-6]
U13  SP2526A-2  [SOIC-8S]
X1  24 MHz  [OSC_4A_S_3225]

### Nets
VDD3V3: R31.2
VDD3V3U: C25.2 C26.2 C27.2 C28.2 C29.2 R21.2 R26.2 R28.2 U10.4(VDD33) U10.10(VDD33) U10.14(VDD33) U10.20(VDD33) U10.27(VDD33)
VDD5V: R32.2 R33.2 U11.5(VDD) U12.5(VDD) U13.7(IN)
VDD-USBD: J6.1(5V) R22.1
VDD-USBH: C30.2 J7.1(5V) U13.5(OUTB)
VSS: C20.1 C21.1 C22.1 C23.1 C24.1 C25.1 C26.1 C27.1 C28.1 C29.1 C30.1 J6.4(G) J6.A(S) J6.B(S) J7.4(G) J7.A(S) J7.B(S) J7.C(S) R23.2 R25.2 R29.2 R30.1 U10.6(TEST) U10.15(TEST1) U10.P(GND) U11.2(GND) U12.2(GND) U13.6(GND) X1.2 X1.4
UDBG-DM: U10.28(USBDM_DN1)
UDBG-DP: U10.1(USBDP_DN1)
UDBG-VBUS: U10.7(PRTPWR1)
UHUB-DM: J6.2(D-) U10.21(USBDM_UP) U11.6(IO)
UHUB-DP: J6.3(D+) U10.22(USBDP_UP) U11.4(IO)
UOTG-DM: U10.2(USBDM_DN2)
UOTG-DP: U10.3(USBDP_DN2)
UOTG-VBUS: R24.2 R27.2
USBH-DM: J7.2(D-) U12.4(IO)
USBH-DP: J7.3(D+) U12.6(IO)
USBH-OCn: R31.1 U13.3(FLGB)
USBH-PWREN: R32.1 U13.4(ENB)
NetC20_2: C20.2 R21.1 U10.17(RESET_N)
NetC21_2: C21.2 U10.24(XTALIN) X1.3
NetC22_2: C22.2 U10.23(XTALOUT) X1.1
NetC23_2: C23.2 U10.9(CRFILT)
NetC24_2: C24.2 U10.25(PLLFILT)
NetR22_2: R22.2 R23.1 R24.1 U10.18(VBUS_DET)
NetR25_1: R25.1 R26.1 U10.19(SUSP_IND/NON_REM0)
NetR27_1: R27.1 U10.11(PRTPWR2)
NetR28_1: R28.1 R29.1 U10.13(NON_REM1)
NetR30_2: R30.2 U10.26(RBIAS)
NetR33_1: R33.1 U13.1(ENA)

Not connected (* = marked no-connect by the designer): U10 5(NC)* 8(OCS_N1)* 12(OCS_N2)* 16(HS_IND)*; U11 1(IO)* 3(IO)*; U12 1(IO)* 3(IO)*; U13 2(FLGA)* 8(OUTA)*

### Notes on the sheet
- Title:
- Project:
- Sheet:
- Of
- Size:
- D/N:
- Rev:
- Date:
- P/N:
- S/N:
- Designer:
- C

### Library data of the parts
C20-C30 = CAP: as C1 on sheet 02_IO_PORTS; SerialNumber: 0; Publisher: Cowin; PCBMarker: Capacitor; Version: 1.0; VersionDate: 04-27-2011; PinCountHole: 0
  C20 C23-C30: Value: 100 nF
  C21 C22: Value: 15 pF
J6 = USBD_JACK: USB Device Jack; Vendor: Foxconn; PartNumber: *; PCBMarker: *; SerialNumber: *
J7 = USBH_JACK: USB Host Jack; Vendor: Foxconn; PartNumber: *; PCBMarker: USB Host; SerialNumber: *
R21-R33 = RES: as R1 on sheet 02_IO_PORTS; SerialNumber: 0; Version: 1.0; VersionDate: 04-27-2011; PCBMarker: Resistor; Publisher: Cowin; PinCountHole: 0
  R21: Value: 110 K
  R22 R23: Value: 100 K
  R24 R25 R29: Value: NC
  R26 R28 R31-R33: Value: 4.7 K
  R27: Value: 0 R
  R30: Value: 12.1 K, 1%
U10 = USB2412: Embedded USB Hub; PartNumber: USB2412-DZK; Vendor: SMSC; PinCountSMD: 29; PinCountHole: 0; Designer: shyul; PCBMarker: PHY; Value: USB2412; Version: 1.0; VersionDate: 03-26-2012; SerialNumber: 0; Publisher: Cowin
U11 U12 = ESD_4A: 4-way TVS Diodes; PartNumber: LXES2SBAA4-016; Vendor: muRata; Designer: shyul; PinCountSMD: 6; PinCountHole: 0; SerialNumber: *; Publisher: Cowin; PCBMarker: *; Value: TVS; Version: 1.0; VersionDate: 04-28-2011
U13 = SP2526A-2: as U1 on sheet 02_IO_PORTS; Value: SP2526A-2; Version: 1.0; VersionDate: 03-26-2012; SerialNumber: 0; Publisher: Cowin
X1 = OSC_2B: Crystal; PartNumber: 0; Vendor: KDS; Designer: shyul; PinCountSMD: 4; Value: 24 MHz; SerialNumber: 0; Publisher: Cowin; PCBMarker: Crystal; Version: 1.0; VersionDate: 04-29-2011; PinCountHole: 0

## Sheet 06_ETHERNET.SchDoc: RMII 10/100Mbps Ethernet
size 381 x 266 mm; Organization: Meteroi; Address1: Room 428, 410 Guiping Rd.; Address2: Shanghai 200233, CHINA; SheetNumber: 6; SheetTotal: 9; PageSetup: Record=PageOptions|CenterHorizontal=True|CenterVertical=True|PrintScale=0.75|XCorrection=1.00|YCorrection=1.00|PrintKind=2|BorderSize=5000000|LeftOffset=0|BottomOffset=0|Orientation=2|PaperLength=1000|PaperWidth=1000|Scale=100|PaperSource=276|PrintQuality=-3|MediaType=1|DitherType=10|PaperKind=A4|PrintScaleMode=1
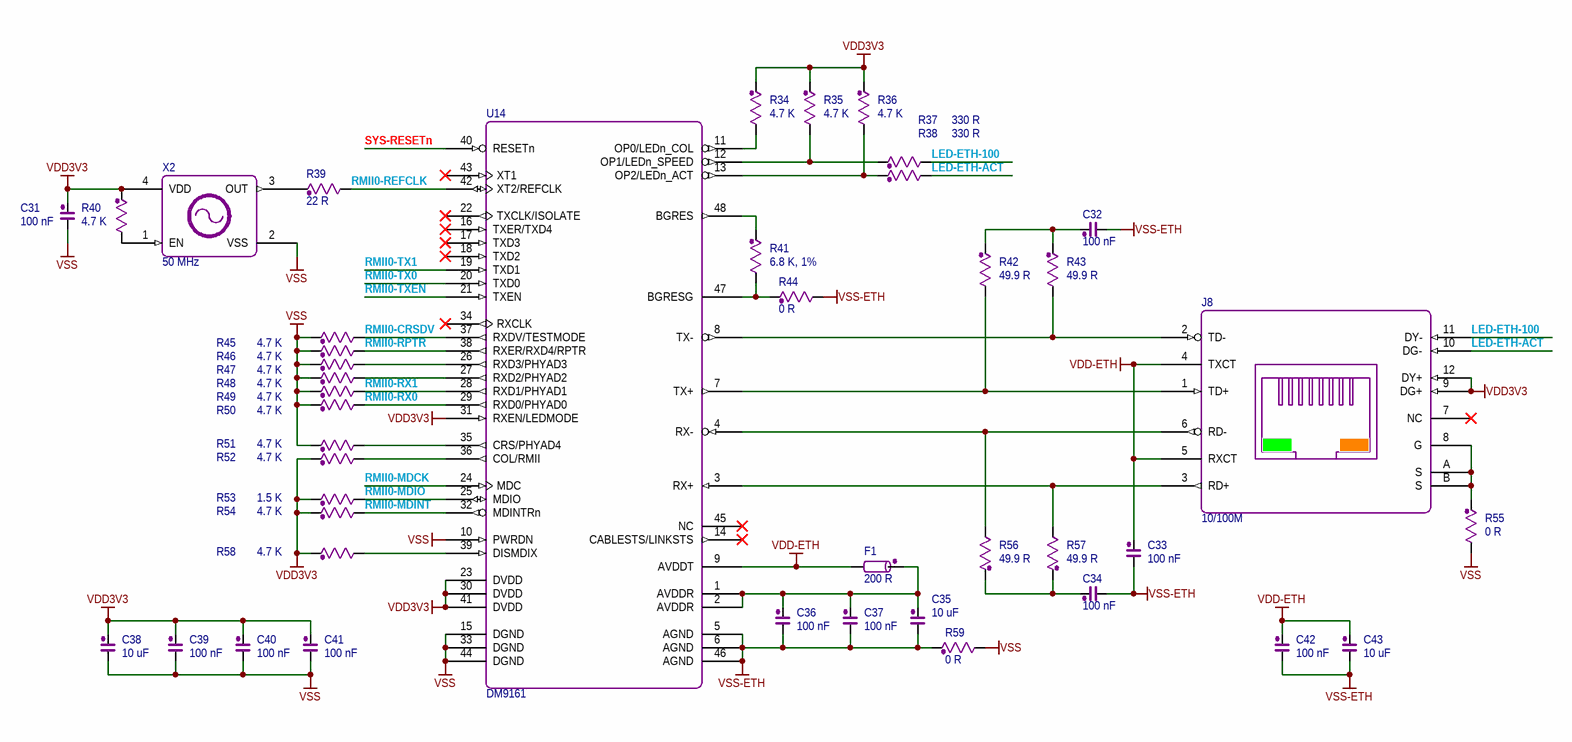
[diagram p5: 06_ETHERNET.SchDoc]

### Parts
C31  100 nF  [0402A1]
C32  100 nF  [0603A1]
C33  100 nF  [0603A1]
C34  100 nF  [0603A1]
C35  10 uF  [0603A1]
C36  100 nF  [0402A1]
C37  100 nF  [0402A1]
C38  10 uF  [0603A1]
C39  100 nF  [0402A1]
C40  100 nF  [0402A1]
C41  100 nF  [0402A1]
C42  100 nF  [0402A1]
C43  10 uF  [0603A1]
F1  200 R  [0603A3]
J8  10/100M  [RJ45_JACK_B]
R34  4.7 K  [0402A2]
R35  4.7 K  [0402A2]
R36  4.7 K  [0402A2]
R37  330 R  [0402A2]
R38  330 R  [0402A2]
R39  22 R  [0402A2]
R40  4.7 K  [0402A2]
R41  6.8 K, 1%  [0603A2]
R42  49.9 R  [0603A2]
R43  49.9 R  [0603A2]
R44  0 R  [0402A2]
R45  4.7 K  [0402A2]
R46  4.7 K  [0402A2]
R47  4.7 K  [0402A2]
R48  4.7 K  [0402A2]
R49  4.7 K  [0402A2]
R50  4.7 K  [0402A2]
R51  4.7 K  [0402A2]
R52  4.7 K  [0402A2]
R53  1.5 K  [0402A2]
R54  4.7 K  [0402A2]
R55  0 R  [0603A2]
R56  49.9 R  [0603A2]
R57  49.9 R  [0603A2]
R58  4.7 K  [0402A2]
R59  0 R  [0603A2]
U14  DM9161  [TQFP-48A]
X2  50 MHz  [OSC_4B_S_5032]

### Nets
VDD3V3: C31.2 C38.2 C39.2 C40.2 C41.2 J8.9(DG+) J8.12(DY+) R34.2 R35.2 R36.2 R40.2 R52.2 R53.2 R54.2 R58.2 U14.23(DVDD) U14.30(DVDD) U14.31(RXEN/LEDMODE) U14.41(DVDD) X2.4(VDD)
VDD-ETH: C33.2 C42.2 C43.2 F1.1 J8.4(TXCT) J8.5(RXCT) U14.9(AVDDT)
VSS: C31.1 C38.1 C39.1 C40.1 C41.1 R45.2 R46.2 R47.2 R48.2 R49.2 R50.2 R51.2 R55.1 R59.1 U14.10(PWRDN) U14.15(DGND) U14.33(DGND) U14.44(DGND) X2.2(VSS)
VSS-ETH: C32.1 C33.1 C34.1 C35.1 C36.1 C37.1 C42.1 C43.1 R44.1 R59.2 U14.5(AGND) U14.6(AGND) U14.46(AGND)
LED-ETH-100: J8.11(DY-) R37.1
LED-ETH-ACT: J8.10(DG-) R38.1
RMII0-CRSDV: R45.1 U14.37(RXDV/TESTMODE)
RMII0-MDCK: U14.24(MDC)
RMII0-MDINT: R54.1 U14.32(MDINTRn)
RMII0-MDIO: R53.1 U14.25(MDIO)
RMII0-REFCLK: R39.1 U14.42(XT2/REFCLK)
RMII0-RPTR: R46.1 U14.38(RXER/RXD4/RPTR)
RMII0-RX0: R50.1 U14.29(RXD0/PHYAD0)
RMII0-RX1: R49.1 U14.28(RXD1/PHYAD1)
RMII0-TX0: U14.20(TXD0)
RMII0-TX1: U14.19(TXD1)
RMII0-TXEN: U14.21(TXEN)
SYS-RESETn: U14.40(RESETn)
NetC32_2: C32.2 R42.2 R43.2
NetC34_2: C34.2 R56.2 R57.2
NetC35_2: C35.2 C36.2 C37.2 F1.2 U14.1(AVDDR) U14.2(AVDDR)
NetJ8_1: J8.1(TD+) R42.1 U14.7(TX+)
NetJ8_2: J8.2(TD-) R43.1 U14.8(TX-)
NetJ8_3: J8.3(RD+) R57.1 U14.3(RX+)
NetJ8_6: J8.6(RD-) R56.1 U14.4(RX-)
NetJ8_8: J8.8(G) J8.A(S) J8.B(S) R55.2
NetR34_1: R34.1 U14.11(OP0/LEDn_COL)
NetR35_1: R35.1 R37.2 U14.12(OP1/LEDn_SPEED)
NetR36_1: R36.1 R38.2 U14.13(OP2/LEDn_ACT)
NetR39_2: R39.2 X2.3(OUT)
NetR40_1: R40.1 X2.1(EN)
NetR41_1: R41.1 R44.2 U14.47(BGRESG)
NetR41_2: R41.2 U14.48(BGRES)
NetR47_1: R47.1 U14.26(RXD3/PHYAD3)
NetR48_1: R48.1 U14.27(RXD2/PHYAD2)
NetR51_1: R51.1 U14.35(CRS/PHYAD4)
NetR52_1: R52.1 U14.36(COL/RMII)
NetR58_1: R58.1 U14.39(DISMDIX)

Not connected (* = marked no-connect by the designer): J8 7(NC)*; U14 14(CABLESTS/LINKSTS)* 16(TXER/TXD4)* 17(TXD3)* 18(TXD2)* 22(TXCLK/ISOLATE)* 34(RXCLK)* 43(XT1)* 45(NC)*

### Notes on the sheet
- Title:
- Project:
- Sheet:
- Of
- Size:
- D/N:
- Rev:
- Date:
- P/N:
- S/N:
- Designer:
- C

### Library data of the parts
C31-C43 = CAP: as C1 on sheet 02_IO_PORTS; SerialNumber: 0; Publisher: Cowin; PCBMarker: Capacitor; Version: 1.0; VersionDate: 04-27-2011; PinCountHole: 0
  C31-C34 C36 C37 C39-C42: Value: 100 nF
  C35 C38 C43: Value: 10 uF
F1 = BEAD: EMI Bead; PartNumber: BLM; SerialNumber: 0; Vendor: muRata; Designer: shyul; PinCountSMD: 2; PCBMarker: Bead; Version: 1.0; Value: 200 R; VersionDate: 04-28-2011; Publisher: Cowin; PinCountHole: 0
J8 = RJ45_JACK_B: RJ45 Pulse Jack with LED; PartNumber: J0011D21B; PCBMarker: 0; Designer: shyul; SerialNumber: 0; Vendor: Pulse; Version: 1.0; VersionDate: 07-05-2011; Value: 10/100M; Publisher: Cowin
R34-R59 = RES: as R1 on sheet 02_IO_PORTS; SerialNumber: 0; Version: 1.0; VersionDate: 04-27-2011; PCBMarker: Resistor; Publisher: Cowin; PinCountHole: 0
  R34-R36 R40 R45-R52 R54 R58: Value: 4.7 K
  R37 R38: Value: 330 R
  R39: Value: 22 R
  R41: Value: 6.8 K, 1%
  R42 R43 R56 R57: Value: 49.9 R
  R44 R55 R59: Value: 0 R
  R53: Value: 1.5 K
U14 = DM9161: DM9161 10/100M Ethernet PHY; PartNumber: DM9161AEP; Vendor: DAVICOM; PinCountSMD: 48; PinCountHole: 0; Designer: shyul; Value: DM9161; Version: 1.0; VersionDate: 03-26-2012; SerialNumber: 0; Publisher: Cowin; PCBMarker: PHY
X2 = OSC_4B: Crystal Oscillator; PartNumber: 0; Vendor: KDS; Designer: shyul; Value: 50 MHz; SerialNumber: 0; Publisher: Cowin; PCBMarker: Crystal Oscillator; Version: 1.0; VersionDate: 04-29-2011

## Sheet 07_AC97_AUDIO.SchDoc: AC97 Audio with Optical SPDIF
size 381 x 266 mm; Organization: Meteroi; Address1: Room 428, 410 Guiping Rd.; Address2: Shanghai 200233, CHINA; SheetNumber: 7; SheetTotal: 9; PageSetup: Record=PageOptions|CenterHorizontal=True|CenterVertical=True|PrintScale=0.75|XCorrection=1.00|YCorrection=1.00|PrintKind=2|BorderSize=5000000|LeftOffset=0|BottomOffset=0|Orientation=2|PaperLength=1000|PaperWidth=1000|Scale=100|PaperSource=276|PrintQuality=-3|MediaType=1|DitherType=10|PaperKind=A4|PrintScaleMode=1
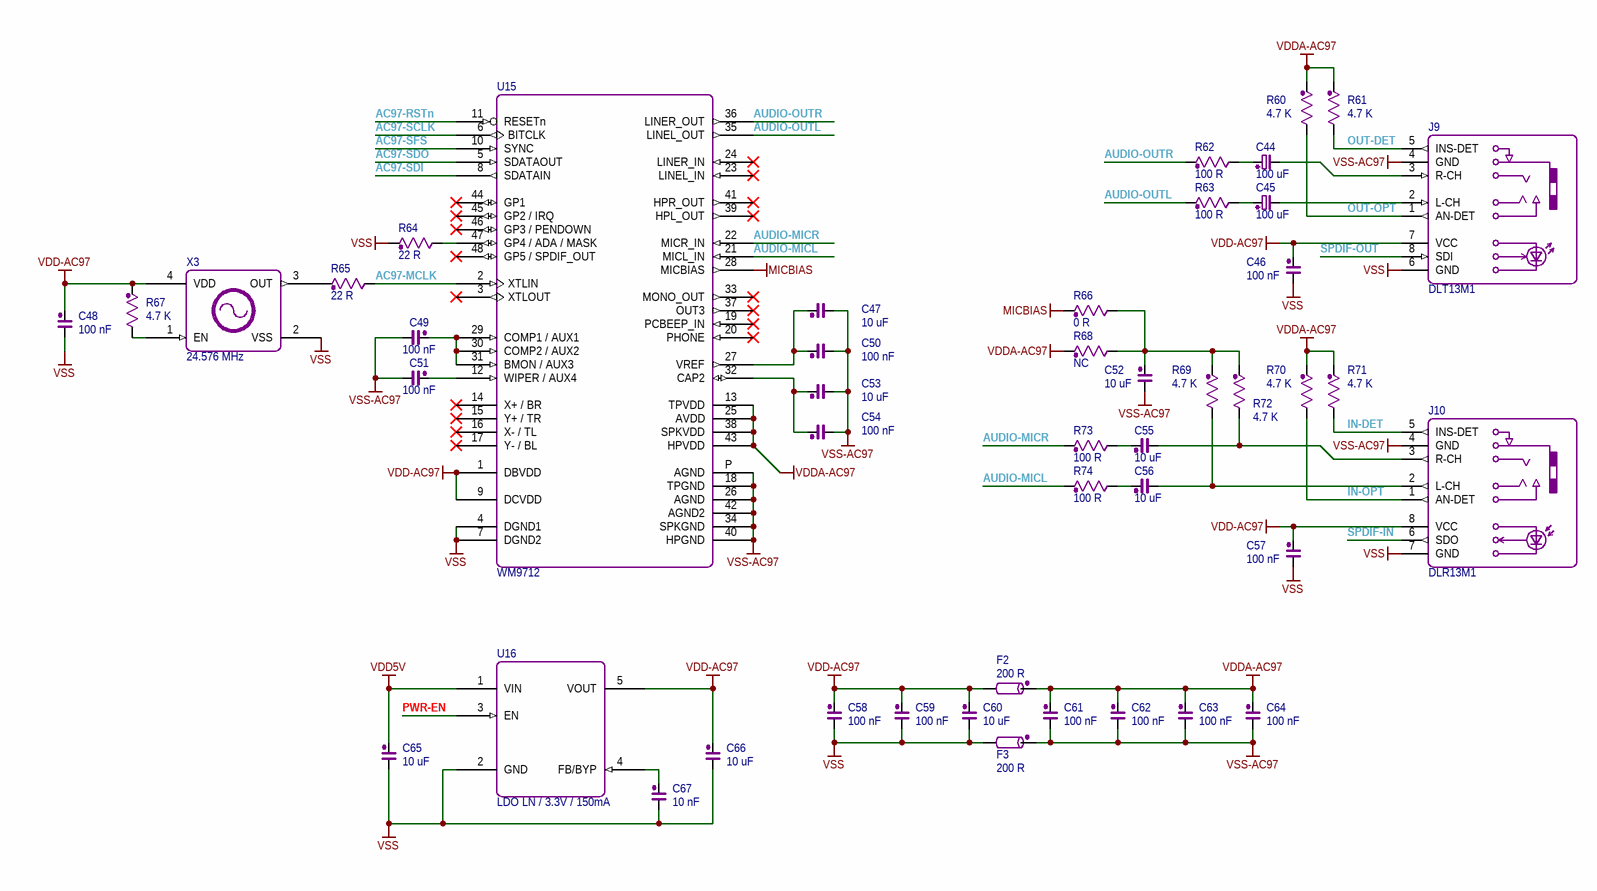
[diagram p6: 07_AC97_AUDIO.SchDoc]

### Parts
C44  100 uF  [CAP_EB]
C45  100 uF  [CAP_EB]
C46  100 nF  [0603A1]
C47  10 uF  [0603A1]
C48  100 nF  [0402A1]
C49  100 nF  [0402A1]
C50  100 nF  [0402A1]
C51  100 nF  [0402A1]
C52  10 uF  [0603A1]
C53  10 uF  [0603A1]
C54  100 nF  [0402A1]
C55  10 uF  [1210A1]
C56  10 uF  [1210A1]
C57  100 nF  [0603A1]
C58  100 nF  [0402A1]
C59  100 nF  [0402A1]
C60  10 uF  [0603A1]
C61  100 nF  [0402A1]
C62  100 nF  [0402A1]
C63  100 nF  [0402A1]
C64  100 nF  [0402A1]
C65  10 uF  [0603A1]
C66  10 uF  [0603A1]
C67  10 nF  [0402A1]
F2  200 R  [0603A3]
F3  200 R  [0603A3]
J9  DLT13M1  [DLT13M1]
J10  DLR13M1  [DLR13M1]
R60  4.7 K  [0603A2]
R61  4.7 K  [0603A2]
R62  100 R  [0603A2]
R63  100 R  [0603A2]
R64  22 R  [0402A2]
R65  22 R  [0402A2]
R66  0 R  [0603A2]
R67  4.7 K  [0402A2]
R68  NC  [0603A2]
R69  4.7 K  [0603A2]
R70  4.7 K  [0603A2]
R71  4.7 K  [0603A2]
R72  4.7 K  [0603A2]
R73  100 R  [0603A2]
R74  100 R  [0603A2]
U15  WM9712  [QFN-7-48]
U16  LDO LN / 3.3V / 150mA  [SOT-23-5]
X3  24.576 MHz  [OSC_4B_S_5032]

### Nets
MICBIAS: R66.2 U15.28(MICBIAS)
VDD5V: C65.2 U16.1(VIN)
VDD-AC97: C46.2 C48.2 C57.2 C58.2 C59.2 C60.2 C66.2 F2.1 J9.7(VCC) J10.8(VCC) R67.2 U15.1(DBVDD) U15.9(DCVDD) U16.5(VOUT) X3.4(VDD)
VDDA-AC97: C61.2 C62.2 C63.2 C64.2 F2.2 R60.2 R61.2 R68.2 R70.2 R71.2 U15.13(TPVDD) U15.25(AVDD) U15.38(SPKVDD) U15.43(HPVDD)
VSS: C46.1 C48.1 C57.1 C58.1 C59.1 C60.1 C65.1 C66.1 C67.1 F3.1 J9.6(GND) J10.7(GND) R64.2 U15.4(DGND1) U15.7(DGND2) U16.2(GND) X3.2(VSS)
VSS-AC97: C47.1 C49.1 C50.1 C51.1 C52.1 C53.1 C54.1 C61.1 C62.1 C63.1 C64.1 F3.2 J9.4(GND) J10.4(GND) U15.18(TPGND) U15.26(AGND) U15.34(SPKGND) U15.40(HPGND) U15.42(AGND2) U15.P(AGND)
AC97-MCLK: R65.1 U15.2(XTLIN)
AC97-RSTn: U15.11(RESETn)
AC97-SCLK: U15.6(BITCLK)
AC97-SDI: U15.8(SDATAIN)
AC97-SDO: U15.5(SDATAOUT)
AC97-SFS: U15.10(SYNC)
AUDIO-MICL: R74.2 U15.21(MICL_IN)
AUDIO-MICR: R73.2 U15.22(MICR_IN)
AUDIO-OUTL: R63.2 U15.35(LINEL_OUT)
AUDIO-OUTR: R62.2 U15.36(LINER_OUT)
IN-DET: J10.5(INS-DET) R71.1
IN-OPT: J10.1(AN-DET) R70.1
OUT-DET: J9.5(INS-DET) R61.1
OUT-OPT: J9.1(AN-DET) R60.1
PWR-EN: U16.3(EN)
SPDIF-IN: J10.6(SDO)
SPDIF-OUT: J9.8(SDI)
NetC44_1: C44.1 J9.3(R-CH)
NetC44_2: C44.2 R62.1
NetC45_1: C45.1 J9.2(L-CH)
NetC45_2: C45.2 R63.1
NetC47_2: C47.2 C50.2 U15.27(VREF)
NetC49_2: C49.2 U15.29(COMP1_/_AUX1) U15.30(COMP2_/_AUX2) U15.31(BMON_/_AUX3)
NetC51_2: C51.2 U15.12(WIPER_/_AUX4)
NetC52_2: C52.2 R66.1 R68.1 R69.2 R72.2
NetC53_2: C53.2 C54.2 U15.32(CAP2)
NetC55_1: C55.1 J10.3(R-CH) R72.1
NetC55_2: C55.2 R73.1
NetC56_1: C56.1 J10.2(L-CH) R69.1
NetC56_2: C56.2 R74.1
NetC67_2: C67.2 U16.4(FB/BYP)
NetR64_1: R64.1 U15.47(GP4_/_ADA_/_MASK)
NetR65_2: R65.2 X3.3(OUT)
NetR67_1: R67.1 X3.1(EN)

Not connected (* = marked no-connect by the designer): U15 3(XTLOUT)* 14(X+_/_BR)* 15(Y+_/_TR)* 16(X-_/_TL)* 17(Y-_/_BL)* 19(PCBEEP_IN)* 20(PHONE)* 23(LINEL_IN)* 24(LINER_IN)* 33(MONO_OUT)* 37(OUT3)* 39(HPL_OUT)* 41(HPR_OUT)* 44(GP1)* 45(GP2_/_IRQ)* 46(GP3_/_PENDOWN)* 48(GP5_/_SPDIF_OUT)*

### Notes on the sheet
- Title:
- Project:
- Sheet:
- Of
- Size:
- D/N:
- Rev:
- Date:
- P/N:
- S/N:
- Designer:
- C

### Library data of the parts
C44 C45 = CAP_E: Electrolyte Capacitor; PartNumber: 0; Designer: shyul; Vendor: AVX; PinCountSMD: 2; SerialNumber: 0; PCBMarker: Capacitor; Publisher: Cowin; Value: 100 uF; Version: 1.0; VersionDate: 04-27-2011; PinCountHole: 0
C46-C67 = CAP: as C1 on sheet 02_IO_PORTS; SerialNumber: 0; Publisher: Cowin; PCBMarker: Capacitor; Version: 1.0; VersionDate: 04-27-2011; PinCountHole: 0
  C46 C48-C51 C54 C57-C59 C61-C64: Value: 100 nF
  C47 C52 C53 C55 C56 C60 C65 C66: Value: 10 uF
  C67: Value: 10 nF
F2 F3 = BEAD: as F1 on sheet 06_ETHERNET; PCBMarker: Bead; Version: 1.0; Value: 200 R; VersionDate: 04-28-2011; Publisher: Cowin; PinCountHole: 0
J9 = DLT13M1: 3.5mm Audio Jack with SPDIF Optical Output; Vendor: Ax-Edison; PinCountSMD: 0; PinCountHole: 9; Designer: shyul; PCBMarker: Audio Out; Value: DLT13M1; PartNumber: DLT13M1; Version: 1.0; VersionDate: 03-16-2012; SerialNumber: 0; Publisher: Cowin
J10 = DLR13M1: 3.5mm Audio Jack with SPDIF Optical Input; Vendor: Ax-Edison; PinCountSMD: 0; PinCountHole: 9; Designer: shyul; PCBMarker: Audio Out; Value: DLR13M1; PartNumber: DLR13M1; Version: 1.0; VersionDate: 03-16-2012; SerialNumber: 0; Publisher: Cowin
R60-R74 = RES: as R1 on sheet 02_IO_PORTS; SerialNumber: 0; Version: 1.0; VersionDate: 04-27-2011; PCBMarker: Resistor; Publisher: Cowin; PinCountHole: 0
  R60 R61 R67 R69-R72: Value: 4.7 K
  R62 R63 R73 R74: Value: 100 R
  R64 R65: Value: 22 R
  R66: Value: 0 R
  R68: Value: NC
U15 = WM9712: WM9712 AC97 Codec; PartNumber: WM9712LGEFL; Vendor: Wolfson; PinCountSMD: 49; PinCountHole: 0; Designer: shyul; Value: WM9712; Version: 1.0; VersionDate: 07-06-2012; SerialNumber: 0; Publisher: Cowin; PCBMarker: AC97
U16 = MIC5265: Low Noise LDO 150mA; PartNumber: MIC5265-3.3YD5; Vendor: Micrel; PinCountSMD: 5; PinCountHole: 0; Designer: shyul; Value: LDO LN / 3.3V / 150mA; Version: 1.0; VersionDate: 05-08-2011; SerialNumber: 0; Publisher: Cowin; PCBMarker: LDO; Supplier 1: Digi-Key; Supplier Part Number 1: 576-2835-2-ND
X3 = OSC_4B: as X2 on sheet 06_ETHERNET; Value: 24.576 MHz; SerialNumber: 0; Publisher: Cowin; PCBMarker: Crystal Oscillator; Version: 1.0; VersionDate: 04-29-2011

## Sheet 08_JTAG_DEBUG.SchDoc: XEM NC pins, JTAG and Debug I/O
size 381 x 266 mm; Organization: Meteroi; Address1: Room 428, 410 Guiping Rd.; Address2: Shanghai 200233, CHINA; SheetNumber: 8; SheetTotal: 9; PageSetup: Record=PageOptions|CenterHorizontal=True|CenterVertical=True|PrintScale=0.75|XCorrection=1.00|YCorrection=1.00|PrintKind=2|BorderSize=5000000|LeftOffset=0|BottomOffset=0|Orientation=2|PaperLength=1000|PaperWidth=1000|Scale=100|PaperSource=276|PrintQuality=-3|MediaType=1|DitherType=10|PaperKind=A4|PrintScaleMode=1
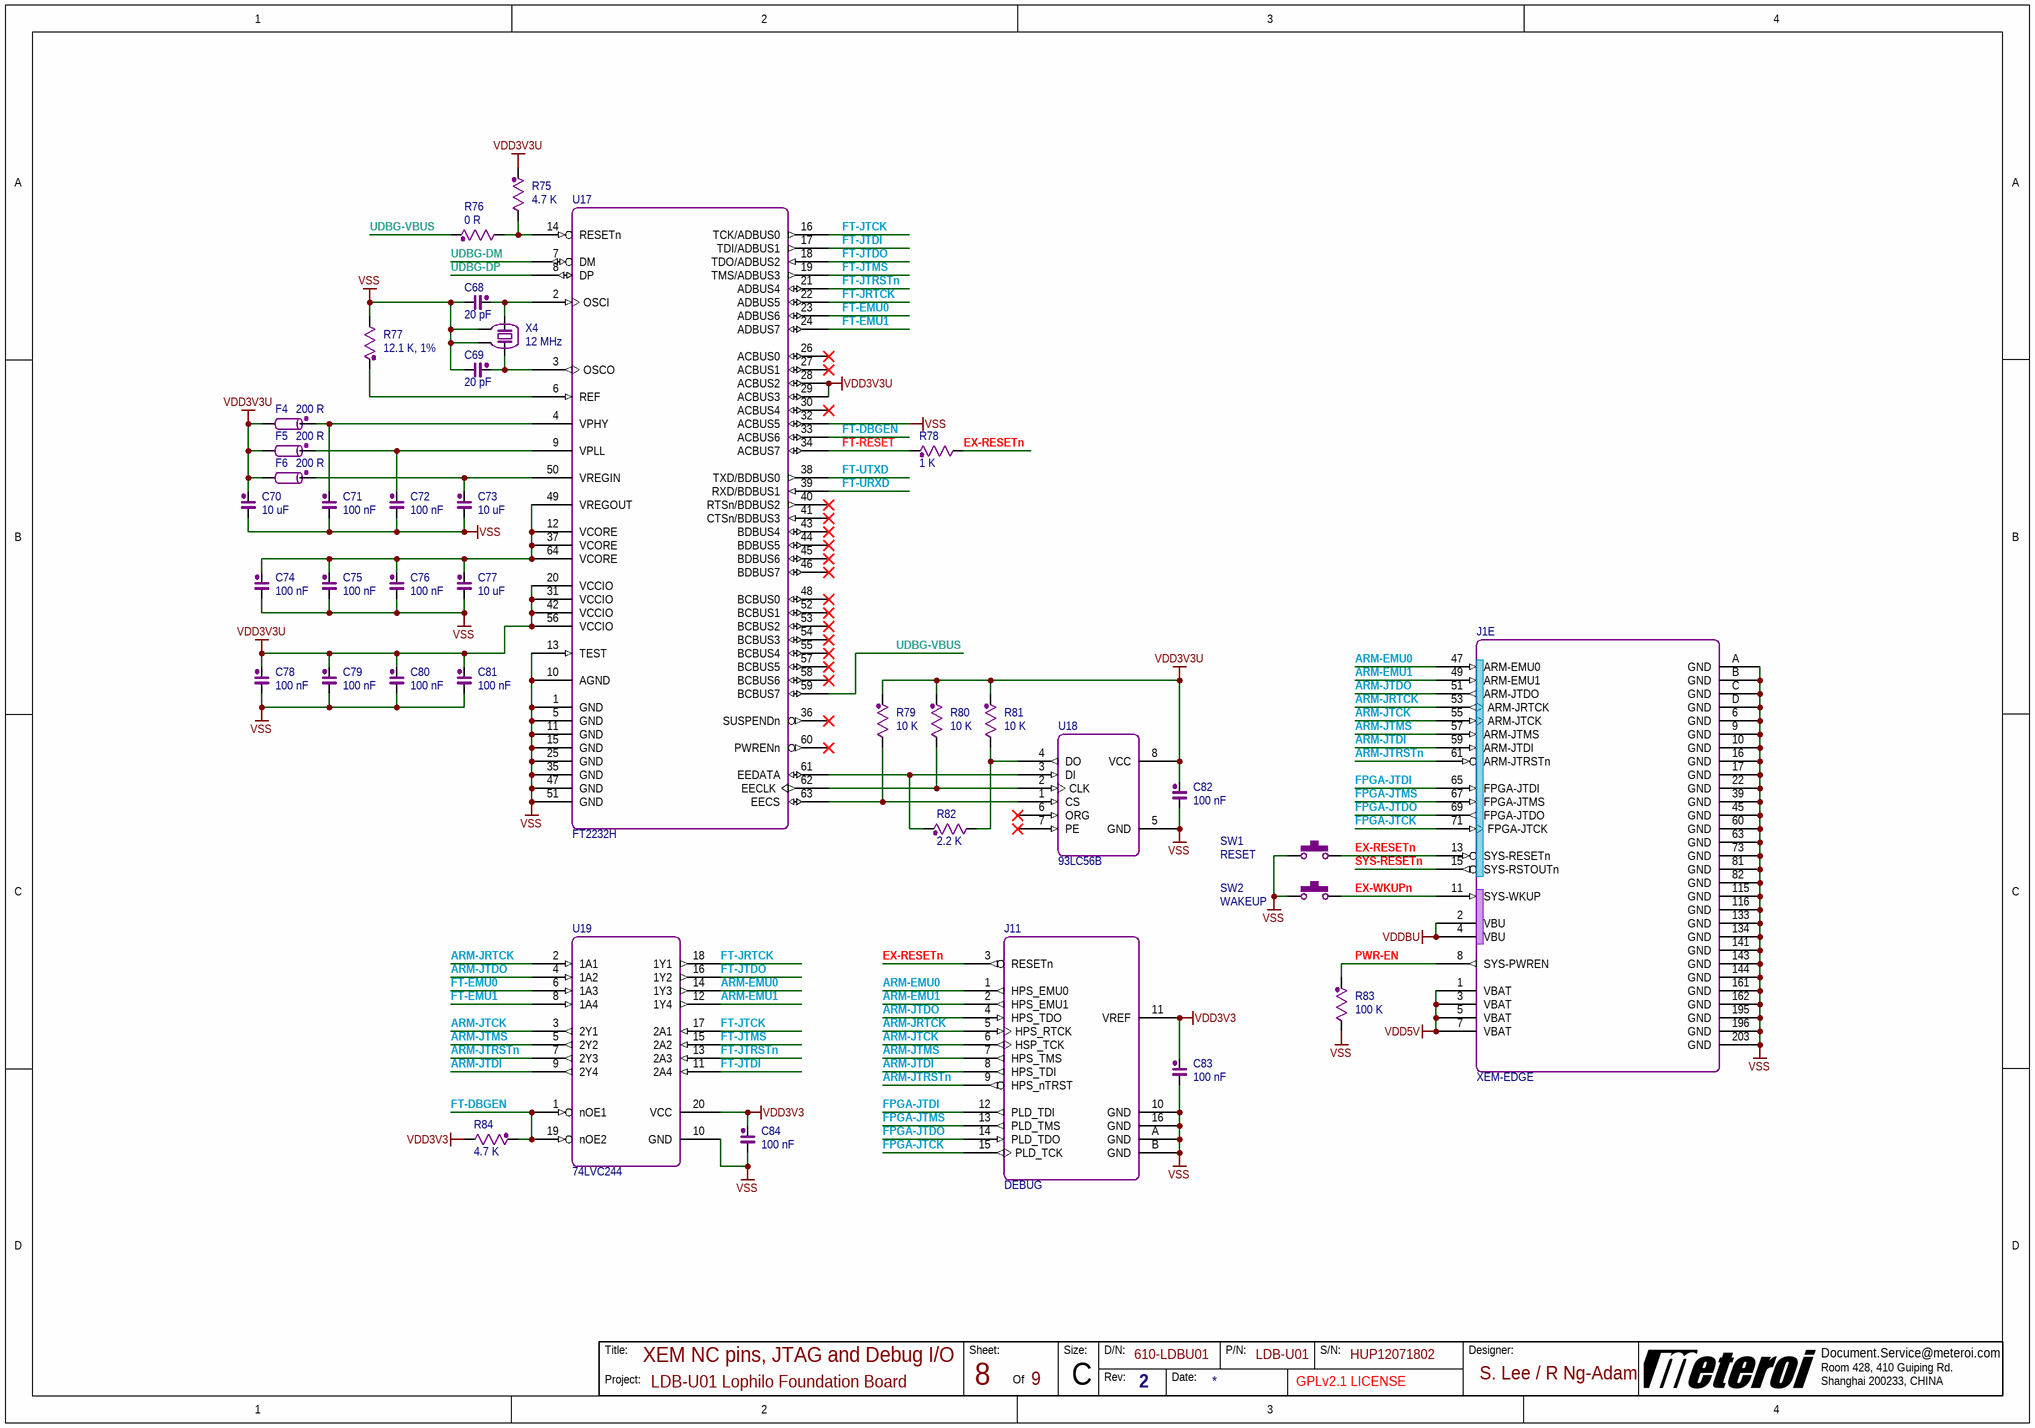
[diagram p7: 08_JTAG_DEBUG.SchDoc]

### Parts
C68  20 pF  [0402A1]
C69  20 pF  [0402A1]
C70  10 uF  [0603A1]
C71  100 nF  [0402A1]
C72  100 nF  [0402A1]
C73  10 uF  [0603A1]
C74  100 nF  [0402A1]
C75  100 nF  [0402A1]
C76  100 nF  [0402A1]
C77  10 uF  [0603A1]
C78  100 nF  [0402A1]
C79  100 nF  [0402A1]
C80  100 nF  [0402A1]
C81  100 nF  [0402A1]
C82  100 nF  [0402A1]
C83  100 nF  [0603A1]
C84  100 nF  [0402A1]
F4  200 R  [0603A3]
F5  200 R  [0603A3]
F6  200 R  [0603A3]
J1  XEM-EDGE  [XEM-1S-204]  (part E of 5)
J11  DEBUG  [HPI_1P25_RA16S]
R75  4.7 K  [0402A2]
R76  0 R  [0402A2]
R77  12.1 K, 1%  [0402A2]
R78  1 K  [0603A2]
R79  10 K  [0402A2]
R80  10 K  [0402A2]
R81  10 K  [0402A2]
R82  2.2 K  [0402A2]
R83  100 K  [0402A2]
R84  4.7 K  [0402A2]
SW1  RESET  [SW_TACT_P_06X06]
SW2  WAKEUP  [SW_TACT_P_06X06]
U17  FT2232H  [TQFP-64A]
U18  93LC56B  [SOIC-8S]
U19  74LVC244  [TSSOP-20]
X4  12 MHz  [OSC_4A_S_3225]

### Nets
VDD3V3: C83.2 C84.2 J11.11(VREF) R84.1 U19.20(VCC)
VDD3V3U: C70.2 C78.2 C79.2 C80.2 C81.2 C82.2 F4.1 F5.1 F6.1 R75.2 R79.2 R80.2 R81.2 U17.20(VCCIO) U17.28(ACBUS2) U17.29(ACBUS3) U17.31(VCCIO) U17.42(VCCIO) U17.56(VCCIO) U18.8(VCC)
VDD5V: J1.1(VBAT) J1.3(VBAT) J1.5(VBAT) J1.7(VBAT)
VDDBU: J1.2(VBU) J1.4(VBU)
VSS: C68.1 C69.1 C70.1 C71.1 C72.1 C73.1 C74.1 C75.1 C76.1 C77.1 C78.1 C79.1 C80.1 C81.1 C82.1 C83.1 C84.1 J1.6(GND) J1.9(GND) J1.10(GND) J1.16(GND) J1.17(GND) J1.22(GND) J1.39(GND) J1.45(GND) J1.60(GND) J1.63(GND) J1.73(GND) J1.81(GND) J1.82(GND) J1.115(GND) J1.116(GND) J1.133(GND) J1.134(GND) J1.141(GND) J1.143(GND) J1.144(GND) J1.161(GND) J1.162(GND) J1.195(GND) J1.196(GND) J1.203(GND) J1.A(GND) J1.B(GND) J1.C(GND) J1.D(GND) J11.10(GND) J11.16(GND) J11.A(GND) J11.B(GND) R77.1 R83.1 SW1.1(KA) SW2.1(KA) U17.1(GND) U17.5(GND) U17.10(AGND) U17.11(GND) U17.13(TEST) U17.15(GND) U17.25(GND) U17.32(ACBUS5) U17.35(GND) U17.47(GND) U17.51(GND) U18.5(GND) U19.10(GND) X4.2 X4.4
ARM-EMU0: J1.47(ARM-EMU0) J11.1(HPS_EMU0) U19.14(1Y3)
ARM-EMU1: J1.49(ARM-EMU1) J11.2(HPS_EMU1) U19.12(1Y4)
ARM-JRTCK: J1.53(ARM-JRTCK) J11.5(HPS_RTCK) U19.2(1A1)
ARM-JTCK: J1.55(ARM-JTCK) J11.6(HSP_TCK) U19.3(2Y1)
ARM-JTDI: J1.59(ARM-JTDI) J11.8(HPS_TDI) U19.9(2Y4)
ARM-JTDO: J1.51(ARM-JTDO) J11.4(HPS_TDO) U19.4(1A2)
ARM-JTMS: J1.57(ARM-JTMS) J11.7(HPS_TMS) U19.5(2Y2)
ARM-JTRSTn: J1.61(ARM-JTRSTn) J11.9(HPS_nTRST) U19.7(2Y3)
EX-RESETn: J1.13(SYS-RESETn) J11.3(RESETn) R78.1 SW1.2(KB)
EX-WKUPn: J1.11(SYS-WKUP) SW2.2(KB)
FPGA-JTCK: J1.71(FPGA-JTCK) J11.15(PLD_TCK)
FPGA-JTDI: J1.65(FPGA-JTDI) J11.12(PLD_TDI)
FPGA-JTDO: J1.69(FPGA-JTDO) J11.14(PLD_TDO)
FPGA-JTMS: J1.67(FPGA-JTMS) J11.13(PLD_TMS)
FT-DBGEN: R84.2 U17.33(ACBUS6) U19.1(nOE1) U19.19(nOE2)
FT-EMU0: U17.23(ADBUS6) U19.6(1A3)
FT-EMU1: U17.24(ADBUS7) U19.8(1A4)
FT-JRTCK: U17.22(ADBUS5) U19.18(1Y1)
FT-JTCK: U17.16(TCK/ADBUS0) U19.17(2A1)
FT-JTDI: U17.17(TDI/ADBUS1) U19.11(2A4)
FT-JTDO: U17.18(TDO/ADBUS2) U19.16(1Y2)
FT-JTMS: U17.19(TMS/ADBUS3) U19.15(2A2)
FT-JTRSTn: U17.21(ADBUS4) U19.13(2A3)
FT-RESET: R78.2 U17.34(ACBUS7)
FT-URXD: U17.39(RXD/BDBUS1)
FT-UTXD: U17.38(TXD/BDBUS0)
PWR-EN: J1.8(SYS-PWREN) R83.2
SYS-RESETn: J1.15(SYS-RSTOUTn)
UDBG-DM: U17.7(DM)
UDBG-DP: U17.8(DP)
UDBG-VBUS: R76.2 U17.59(BCBUS7)
NetC68_2: C68.2 U17.2(OSCI) X4.1
NetC69_2: C69.2 U17.3(OSCO) X4.3
NetC71_2: C71.2 F4.2 U17.4(VPHY)
NetC72_2: C72.2 F5.2 U17.9(VPLL)
NetC73_2: C73.2 F6.2 U17.50(VREGIN)
NetC74_2: C74.2 C75.2 C76.2 C77.2 U17.12(VCORE) U17.37(VCORE) U17.49(VREGOUT) U17.64(VCORE)
NetR75_1: R75.1 R76.1 U17.14(RESETn)
NetR77_2: R77.2 U17.6(REF)
NetR79_1: R79.1 U17.63(EECS) U18.1(CS)
NetR80_1: R80.1 U17.62(EECLK) U18.2(CLK)
NetR81_1: R81.1 R82.1 U18.4(DO)
NetR82_2: R82.2 U17.61(EEDATA) U18.3(DI)

Not connected (* = marked no-connect by the designer): U17 26(ACBUS0)* 27(ACBUS1)* 30(ACBUS4)* 36(SUSPENDn)* 40(RTSn/BDBUS2)* 41(CTSn/BDBUS3)* 43(BDBUS4)* 44(BDBUS5)* 45(BDBUS6)* 46(BDBUS7)* 48(BCBUS0)* 52(BCBUS1)* 53(BCBUS2)* 54(BCBUS3)* 55(BCBUS4)* 57(BCBUS5)* 58(BCBUS6)* 60(PWRENn)*; U18 6(ORG)* 7(PE)*

### Notes on the sheet
- Title:
- Project:
- Sheet:
- Of
- Size:
- D/N:
- Rev:
- Date:
- P/N:
- S/N:
- Designer:
- C

### Library data of the parts
C68-C84 = CAP: as C1 on sheet 02_IO_PORTS; SerialNumber: 0; Publisher: Cowin; PCBMarker: Capacitor; Version: 1.0; VersionDate: 04-27-2011; PinCountHole: 0
  C68 C69: Value: 20 pF
  C70 C73 C77: Value: 10 uF
  C71 C72 C74-C76 C78-C84: Value: 100 nF
F4-F6 = BEAD: as F1 on sheet 06_ETHERNET; PCBMarker: Bead; Version: 1.0; Value: 200 R; VersionDate: 04-28-2011; Publisher: Cowin; PinCountHole: 0
J1 = XEM-SLOT: as J1 on sheet 02_IO_PORTS; Value: XEM-EDGE; PartNumber: XEM-EDGE; Version: 1.0; VersionDate: 03-09-2012; PinCountHole: 0; SerialNumber: 0; Publisher: Cowin; PCBMarker: XEM
J11 = LOP_DEBUG: JTAG HPI Header; SerialNumber: 0; Vendor: Tyco; Designer: shyul; PCBMarker: DEBUG; PartNumber: DEBUG; Version: 1.0; VersionDate: 03-30-2012; Value: DEBUG; Publisher: Cowin; PinCountHole: 0
R75-R84 = RES: as R1 on sheet 02_IO_PORTS; SerialNumber: 0; Version: 1.0; VersionDate: 04-27-2011; PCBMarker: Resistor; Publisher: Cowin; PinCountHole: 0
  R75 R84: Value: 4.7 K
  R76: Value: 0 R
  R77: Value: 12.1 K, 1%
  R78: Value: 1 K
  R79-R81: Value: 10 K
  R82: Value: 2.2 K
  R83: Value: 100 K
SW1 SW2 = SW_TACT_A: Tactile Switch; PartNumber: B3F; Designer: shyul; Vendor: OMRON; SerialNumber: 0; Value: B3F; PCBMarker: Button; Version: 1.0; VersionDate: 05-05-2011; Publisher: Cowin
  SW1: Status: RESET
  SW2: Status: WAKEUP
U17 = FT2232H: USB to JTAG/UART; PartNumber: FT2232HL; Vendor: FTDI; PinCountSMD: 64; PinCountHole: 0; Designer: shyul; PCBMarker: 2232; Value: FT2232H; Version: 1.0; VersionDate: 03-26-2012; SerialNumber: 0; Publisher: Cowin
U18 = ROM_MWIRE: Generic Micro Wire ROM; PartNumber: 93LC56BISN; Vendor: Microchip; SerialNumber: 0; PCBMarker: Micro Wire Serial ROM; PinCountSMD: 8; Designer: shyul; Value: 93LC56B; Version: 1.0; VersionDate: 06-05-2011; Publisher: Cowin; PinCountHole: 0
U19 = 74_244: 8-Bit Driver; PartNumber: SN74LVC244APW; Vendor: TI; PCBMarker: 244 Driver; Designer: shyul; PinCountSMD: 20; PinCountHole: 0; Value: 74LVC244; Version: 1.0; VersionDate: 07-20-2011; Publisher: Cowin; SerialNumber: 0
X4 = OSC_2B: as X1 on sheet 05_USB_PORTS; Value: 12 MHz; SerialNumber: 0; Publisher: Cowin; PCBMarker: Crystal; Version: 1.0; VersionDate: 04-29-2011; PinCountHole: 0

## Sheet 09_POWER.SchDoc: DCDC Power Supply / Misc.
size 381 x 266 mm; Organization: Meteroi; Address1: Room 428, 410 Guiping Rd.; Address2: Shanghai 200233, CHINA; SheetNumber: 9; SheetTotal: 9; PageSetup: Record=PageOptions|CenterHorizontal=True|CenterVertical=True|PrintScale=0.75|XCorrection=1.00|YCorrection=1.00|PrintKind=2|BorderSize=5000000|LeftOffset=0|BottomOffset=0|Orientation=2|PaperLength=1000|PaperWidth=1000|Scale=100|PaperSource=276|PrintQuality=-3|MediaType=1|DitherType=10|PaperKind=A4|PrintScaleMode=1
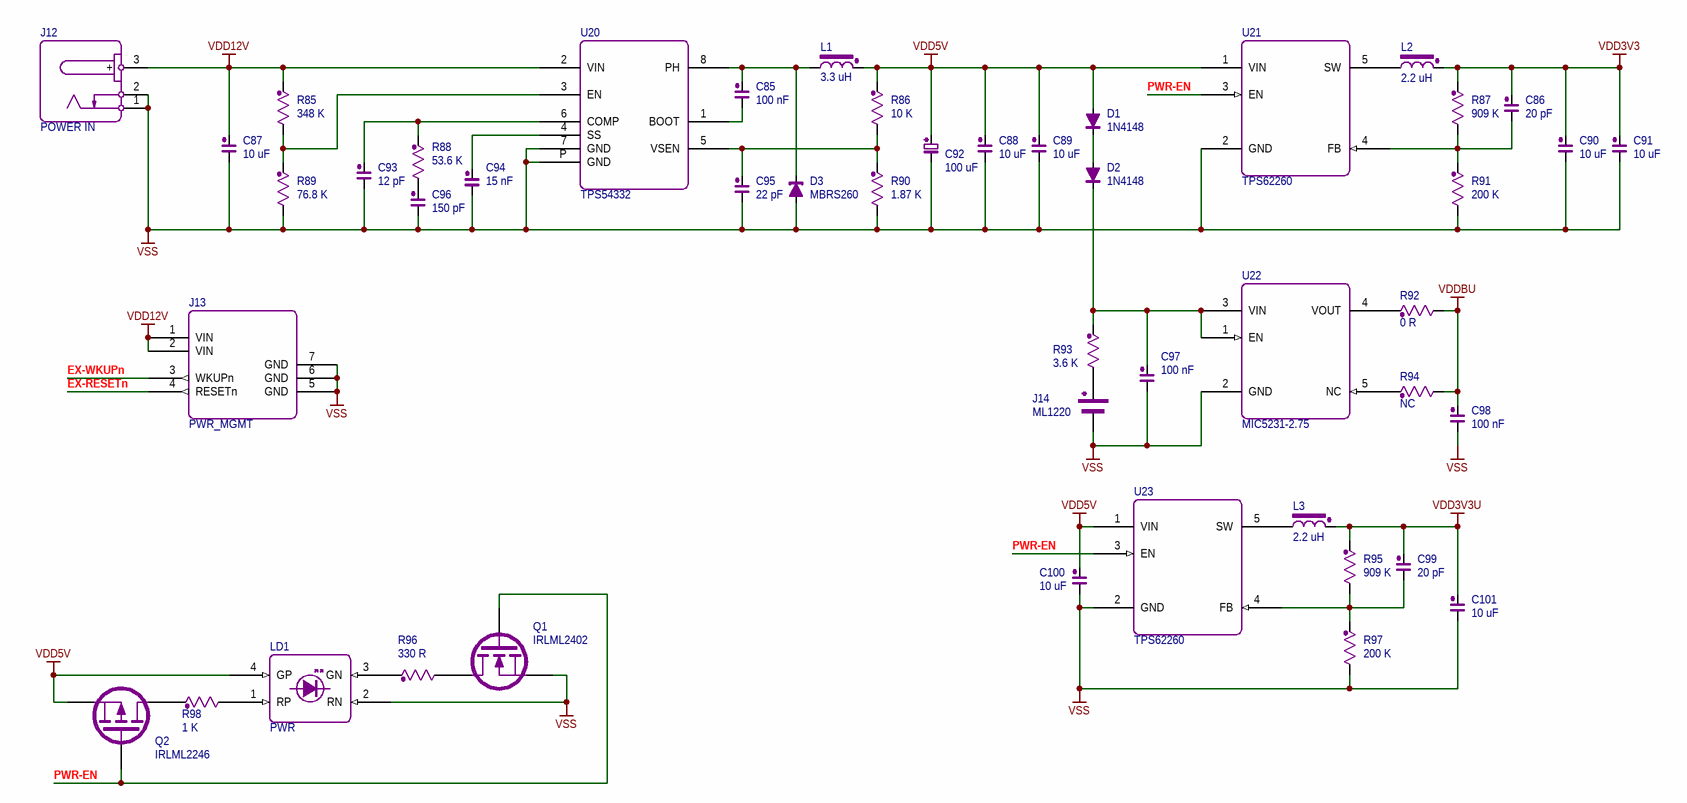
[diagram p8: 09_POWER.SchDoc]

### Parts
C85  100 nF  [0603A1]
C86  20 pF  [0402A1]
C87  10 uF  [1210A1]
C88  10 uF  [0603A1]
C89  10 uF  [0603A1]
C90  10 uF  [0603A1]
C91  10 uF  [0603A1]
C92  100 uF  [CAP_ED]
C93  12 pF  [0603A1]
C94  15 nF  [0603A1]
C95  22 pF  [0603A1]
C96  150 pF  [0603A1]
C97  100 nF  [0603A1]
C98  100 nF  [0603A1]
C99  20 pF  [0402A1]
C100  10 uF  [0603A1]
C101  10 uF  [0603A1]
D1  1N4148  [SOD-123]
D2  1N4148  [SOD-123]
D3  MBRS260  [D-SMB]
J12  POWER IN  [PWRIN_JACK_1]
J13  PWR_MGMT  [PWR_MGMT]
J14  ML1220  [BAT_SCKT_1220]
L1  3.3 uH  [COIL_S_7X7]
L2  2.2 uH  [COIL_S_3X3]
L3  2.2 uH  [COIL_S_3X3]
LD1  PWR  [LED_4A_S_S195]
Q1  IRLML2402  [SOT-23-3]
Q2  IRLML2246  [SOT-23-3]
R85  348 K  [0603A2]
R86  10 K  [0603A2]
R87  909 K  [0402A2]
R88  53.6 K  [0603A2]
R89  76.8 K  [0603A2]
R90  1.87 K  [0603A2]
R91  200 K  [0402A2]
R92  0 R  [0402A2]
R93  3.6 K  [0603A2]
R94  NC  [0402A2]
R95  909 K  [0402A2]
R96  330 R  [0402A2]
R97  200 K  [0402A2]
R98  1 K  [0402A2]
U20  TPS54332  [SOIC-8SE]
U21  TPS62260  [SOT-23-5]
U22  MIC5231-2.75  [SOT-23-5]
U23  TPS62260  [SOT-23-5]

### Nets
VDD3V3: C86.2 C90.2 C91.2 L2.2 R87.2
VDD3V3U: C99.2 C101.2 L3.2 R95.2
VDD5V: C88.2 C89.2 C92.2 C100.2 D1.2 L1.2 LD1.4(GP) Q2.3(S) R86.2 U21.1(VIN) U23.1(VIN)
VDD12V: C87.2 J12.3(+) J13.1(VIN) J13.2(VIN) R85.2 U20.2(VIN)
VDDBU: C98.2 R92.1 R94.1
VSS: C87.1 C88.1 C89.1 C90.1 C91.1 C92.1 C93.1 C94.1 C95.1 C96.1 C97.1 C98.1 C100.1 C101.1 D3.2 J12.1(-) J12.2(J) J13.5(GND) J13.6(GND) J13.7(GND) J14.1 LD1.2(RN) Q1.3(S) R89.1 R90.1 R91.1 R97.1 U20.7(GND) U20.P(GND) U21.2(GND) U22.2(GND) U23.2(GND)
EX-RESETn: J13.4(RESETn)
EX-WKUPn: J13.3(WKUPn)
PWR-EN: Q1.1(G) Q2.1(G) U21.3(EN) U23.3(EN)
NetC85_1: C85.1 U20.1(BOOT)
NetC85_2: C85.2 D3.1 L1.1 U20.8(PH)
NetC86_1: C86.1 R87.1 R91.2 U21.4(FB)
NetC93_2: C93.2 R88.2 U20.6(COMP)
NetC94_2: C94.2 U20.4(SS)
NetC95_2: C95.2 R86.1 R90.2 U20.5(VSEN)
NetC96_2: C96.2 R88.1
NetC97_2: C97.2 D2.1 R93.2 U22.1(EN) U22.3(VIN)
NetC99_1: C99.1 R95.1 R97.2 U23.4(FB)
NetD1_1: D1.1 D2.2
NetJ14_2: J14.2 R93.1
NetL2_1: L2.1 U21.5(SW)
NetL3_1: L3.1 U23.5(SW)
NetLD1_1: LD1.1(RP) R98.1
NetLD1_3: LD1.3(GN) R96.2
NetQ1_2: Q1.2(D) R96.1
NetQ2_2: Q2.2(D) R98.2
NetR85_1: R85.1 R89.2 U20.3(EN)
NetR92_2: R92.2 U22.4(VOUT)
NetR94_2: R94.2 U22.5(NC)

### Notes on the sheet
- Title:
- Project:
- Sheet:
- Of
- Size:
- D/N:
- Rev:
- Date:
- P/N:
- S/N:
- Designer:
- C

### Library data of the parts
C85-C89 C93-C100 = CAP: as C1 on sheet 02_IO_PORTS; SerialNumber: 0; Publisher: Cowin; PCBMarker: Capacitor; Version: 1.0; VersionDate: 04-27-2011; PinCountHole: 0
  C85 C97 C98: Value: 100 nF
  C86 C99: Value: 20 pF
  C87-C89 C100: Value: 10 uF
  C93: Value: 12 pF
  C94: Value: 15 nF
  C95: Value: 22 pF
  C96: Value: 150 pF
C90 C91 C101 = CAP: Normal Capacitor; PartNumber: 0; Value: 100 nF; Vendor: muRata; Designer: shyul; PinCountSMD: 2; SerialNumber: 0; Publisher: Cowin; PCBMarker: Capacitor; Version: 1.0; VersionDate: 04-27-2011; PinCountHole: 0
C92 = CAP_E: as C44 on sheet 07_AC97_AUDIO; SerialNumber: 0; PCBMarker: Capacitor; Publisher: Cowin; Value: 100 uF; Version: 1.0; VersionDate: 04-27-2011; PinCountHole: 0
D1 D2 = DIODE: Normal Diode; PartNumber: 0; Vendor: ONSemi; Designer: shyul; Value: 1N4148; SerialNumber: 0; Version: 1.0; VersionDate: 04-27-2011; Publisher: Cowin; PCBMarker: Diode
D3 = DIODE_S: Schottky Diode; PartNumber: 0; Vendor: ONSemi; Designer: shyul; PinCountSMD: 2; SerialNumber: 0; Value: MBRS260; Version: 1.0; VersionDate: 04-27-2011; Publisher: Cowin; PCBMarker: Schottky Diode; PinCountHole: 0
J12 = PWRIN_JACK_1: Standard Power Input Type 1; PartNumber: *; PCBMarker: *; SerialNumber: *; Vendor: *
J13 = PWR_MGMT: Lophilo Power Management; Vendor: 0; PinCountHole: 7; Designer: shyul; Value: PWR_MGMT; PartNumber: PWR_MGMT; Version: 1.0; VersionDate: 03-27-2012; PinCountSMD: 0; SerialNumber: 0; Publisher: Cowin; PCBMarker: PWR_MGMT
J14 = BAT_A: Battery; PartNumber: SOCKET_1220; SerialNumber: 0; Vendor: AMP; Designer: shyul; Value: ML1220; VersionDate: 04-29-2011; Version: 1.0; Publisher: Cowin; PCBMarker: ML1220
L1 = COIL: Power Coil Inductor; PartNumber: MPLCH0740L3R3(SA); Vendor: NEC / TOKIN; Designer: shyul; PCBMarker: Power Inductor; SerialNumber: 0; PinCountSMD: 2; Value: 3.3 uH; Version: 1.0; VersionDate: 04-27-2011; Publisher: Cowin; PinCountHole: 0
L2 L3 = COIL: Power Coil Inductor; PartNumber: LPS3010-222MLB; Vendor: Coilcraft; Designer: shyul; PCBMarker: Power Inductor; SerialNumber: 0; PinCountSMD: 2; Value: 2.2 uH; Version: 1.0; VersionDate: 04-27-2011; Publisher: Cowin; PinCountHole: 0
LD1 = LED_2A: LED Pack 2; PartNumber: LL-S195VUGC-2B; Value: RG; Designer: shyul; SerialNumber: 0; Vendor: Luckylight; PinCountSMD: 4; Status: PWR; Version: 1.0; VersionDate: 04-27-2011; Publisher: Cowin; PCBMarker: LED; PinCountHole: 0
Q1 = MOSFET_EN: N Channel Enhancement MOSFET; PartNumber: 0; Designer: shyul; Vendor: IR; PinCountSMD: 3; SerialNumber: 0; Publisher: Cowin; Value: IRLML2402; PCBMarker: IRLML2402; Version: 0.1; VersionDate: 04-28-2011; PinCountHole: 0
Q2 = MOSFET_EP: P Channel Enhancement MOSFET; PartNumber: IRLML2246TRPbF; Vendor: ONSemi; Designer: shyul; SerialNumber: 0; PinCountSMD: 3; Value: IRLML2246; Version: 0.1; VersionDate: 04-28-2011; Publisher: Cowin; PCBMarker: MOSFET; PinCountHole: 0
R85-R98 = RES: as R1 on sheet 02_IO_PORTS; SerialNumber: 0; Version: 1.0; VersionDate: 04-27-2011; PCBMarker: Resistor; Publisher: Cowin; PinCountHole: 0
  R85: Value: 348 K
  R86: Value: 10 K
  R87 R95: Value: 909 K
  R88: Value: 53.6 K
  R89: Value: 76.8 K
  R90: Value: 1.87 K
  R91 R97: Value: 200 K
  R92: Value: 0 R
  R93: Value: 3.6 K
  R94: Value: NC
  R96: Value: 330 R
  R98: Value: 1 K
U20 = TPS54332: TI Simple Switch Adjustable 3A; PartNumber: TPS54332DDAR; SerialNumber: 0; PinCountSMD: 9; Designer: shyul; PCBMarker: Power; Value: TPS54332; Version: 1.0; VersionDate: 05-08-2011; Vendor: TI; PinCountHole: 0; Publisher: Cowin; Supplier 1: Digi-Key; Supplier Part Number 1: 296-24141-5-ND
U21 U23 = TPS62260: Simple Switch 600mA Adjustable; PartNumber: TPS62260DDCR; Vendor: TI; PinCountSMD: 5; PinCountHole: 0; Designer: shyul; PCBMarker: Power; Value: TPS62260; Version: 1.0; VersionDate: 05-08-2011; SerialNumber: 0; Publisher: Cowin; Supplier 1: Digi-Key; Supplier Part Number 1: 296-22469-2-ND
U22 = MIC5231: LDO Micro; PartNumber: MIC5231-2.75YM5; Vendor: Micrel; PinCountSMD: 5; PinCountHole: 0; Designer: shyul; Value: MIC5231-2.75; Version: 1.0; VersionDate: 03-27-2012; SerialNumber: 0; Publisher: Cowin; PCBMarker: LDO